# EAGLE design ControlBoard (EAGLE 8.2.2)
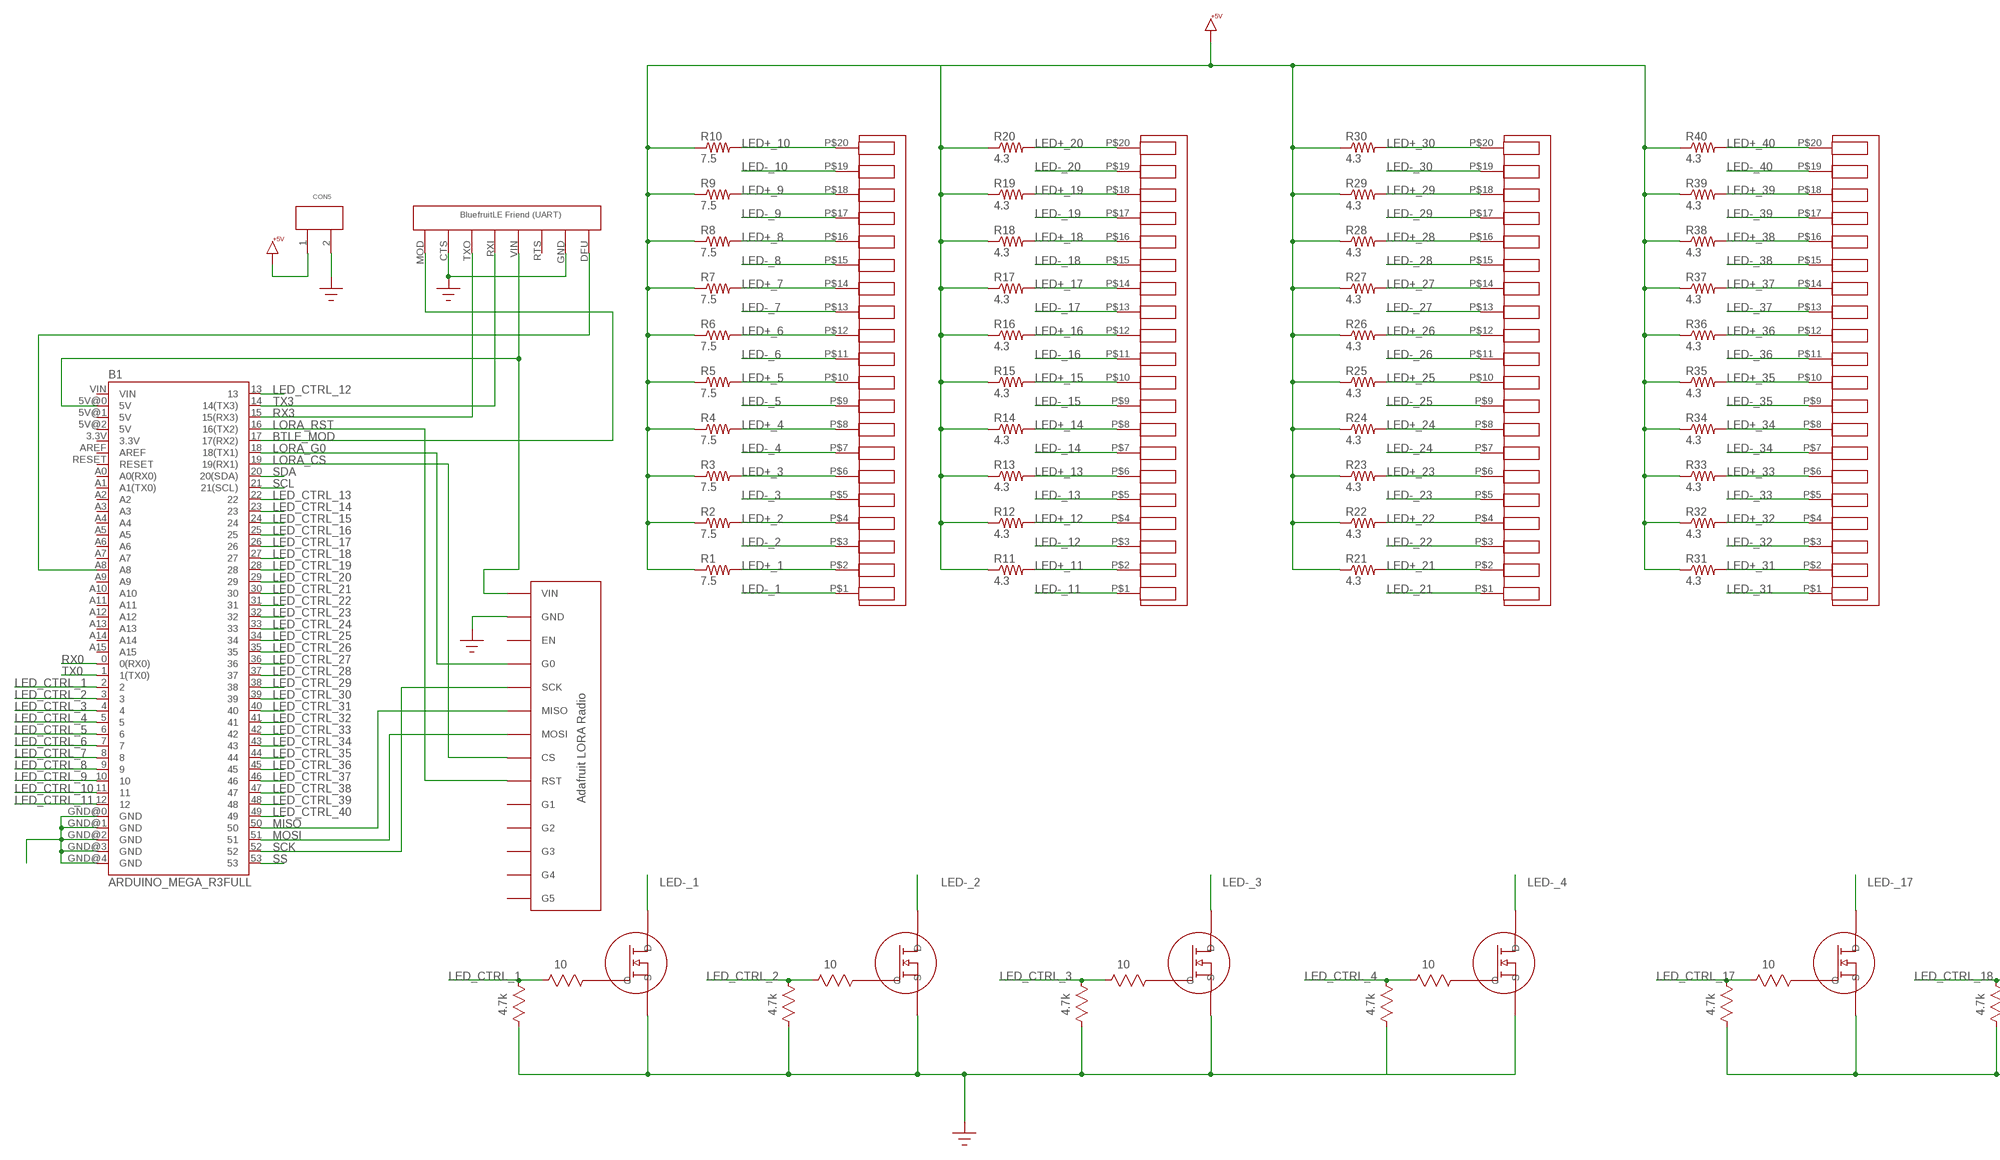
[diagram p0: schematic, sheet 1, part 1 of 3]
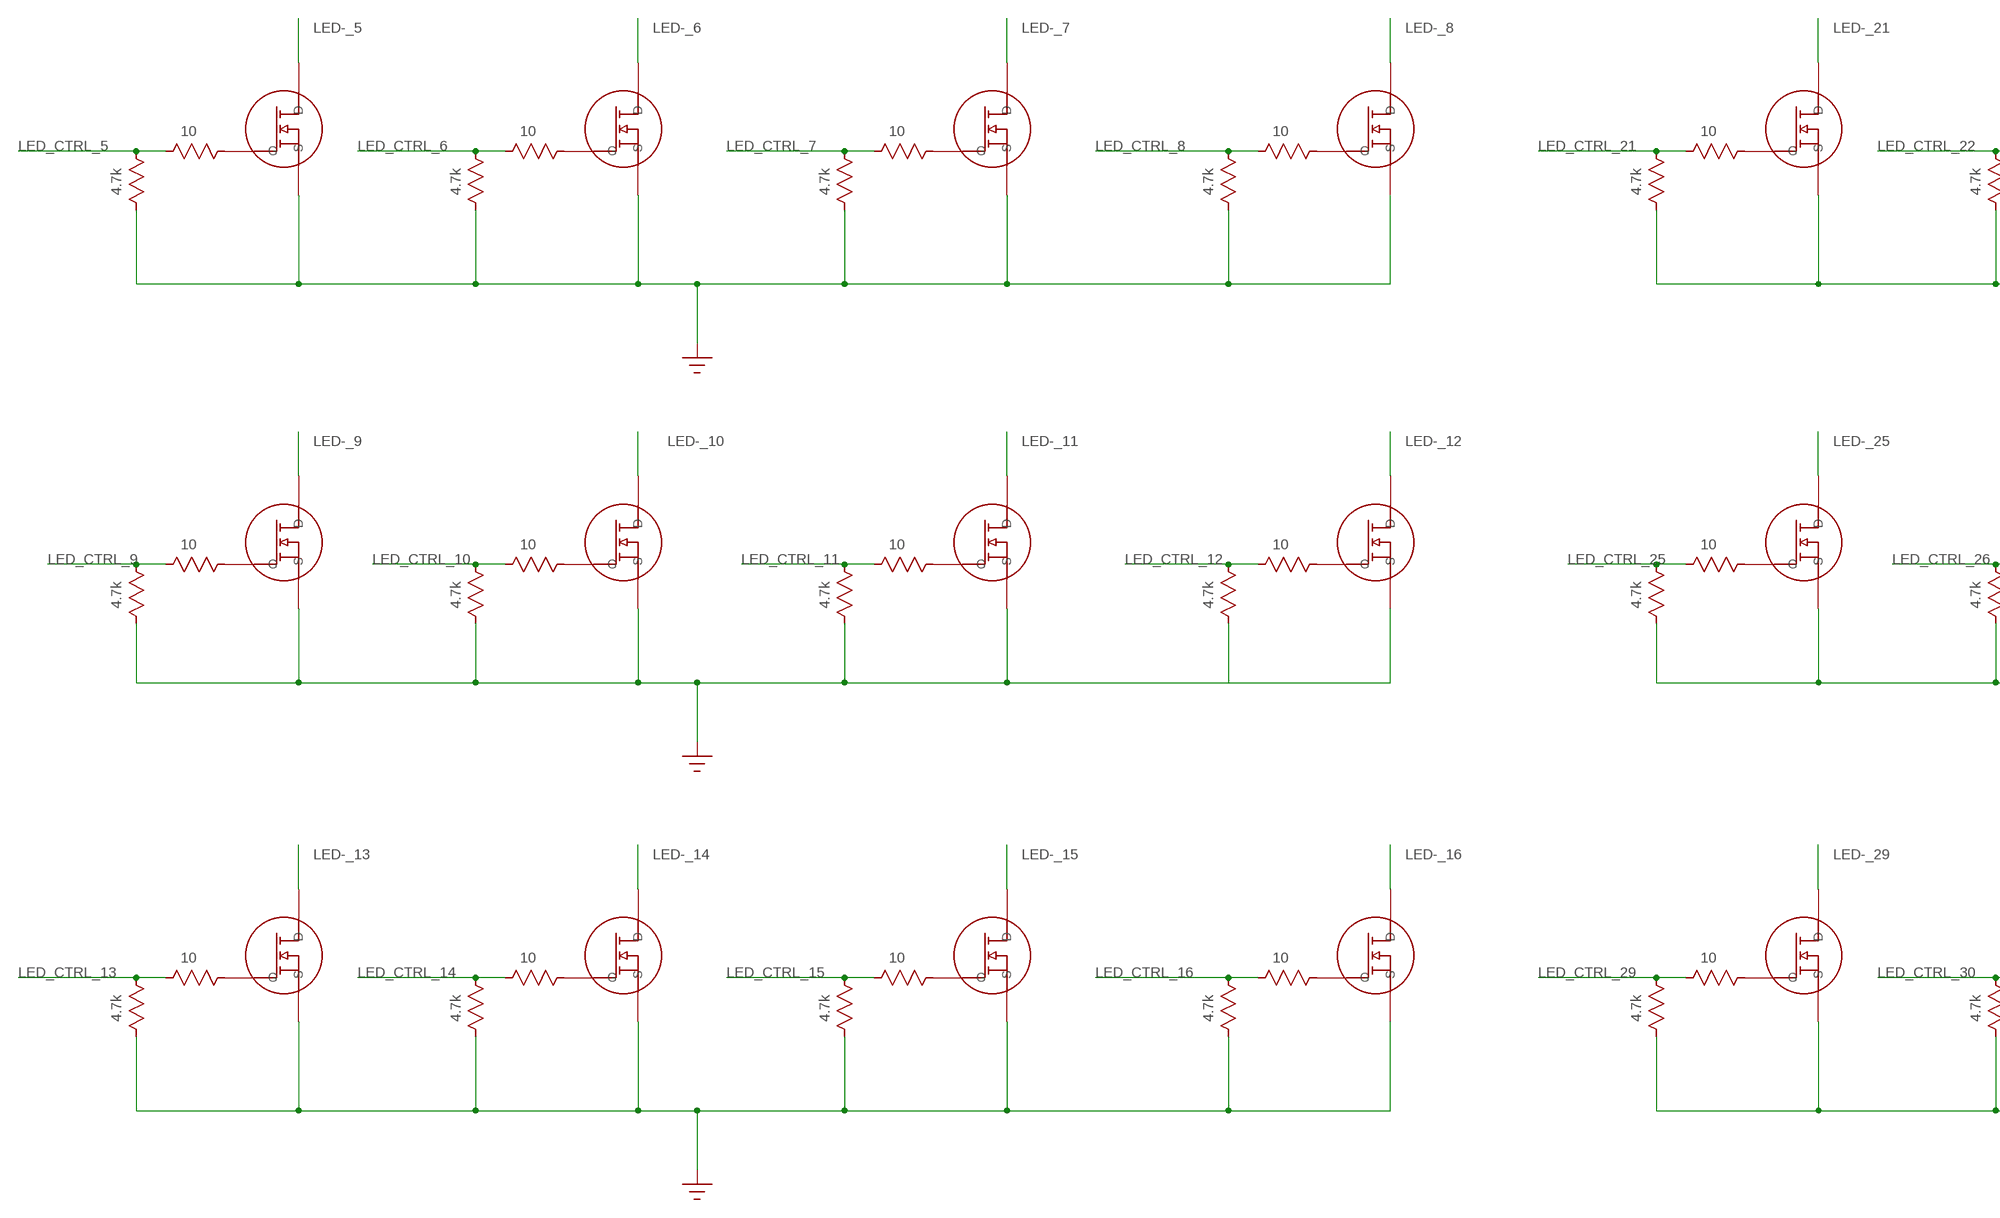
[diagram p1: schematic, sheet 1, part 2 of 3]
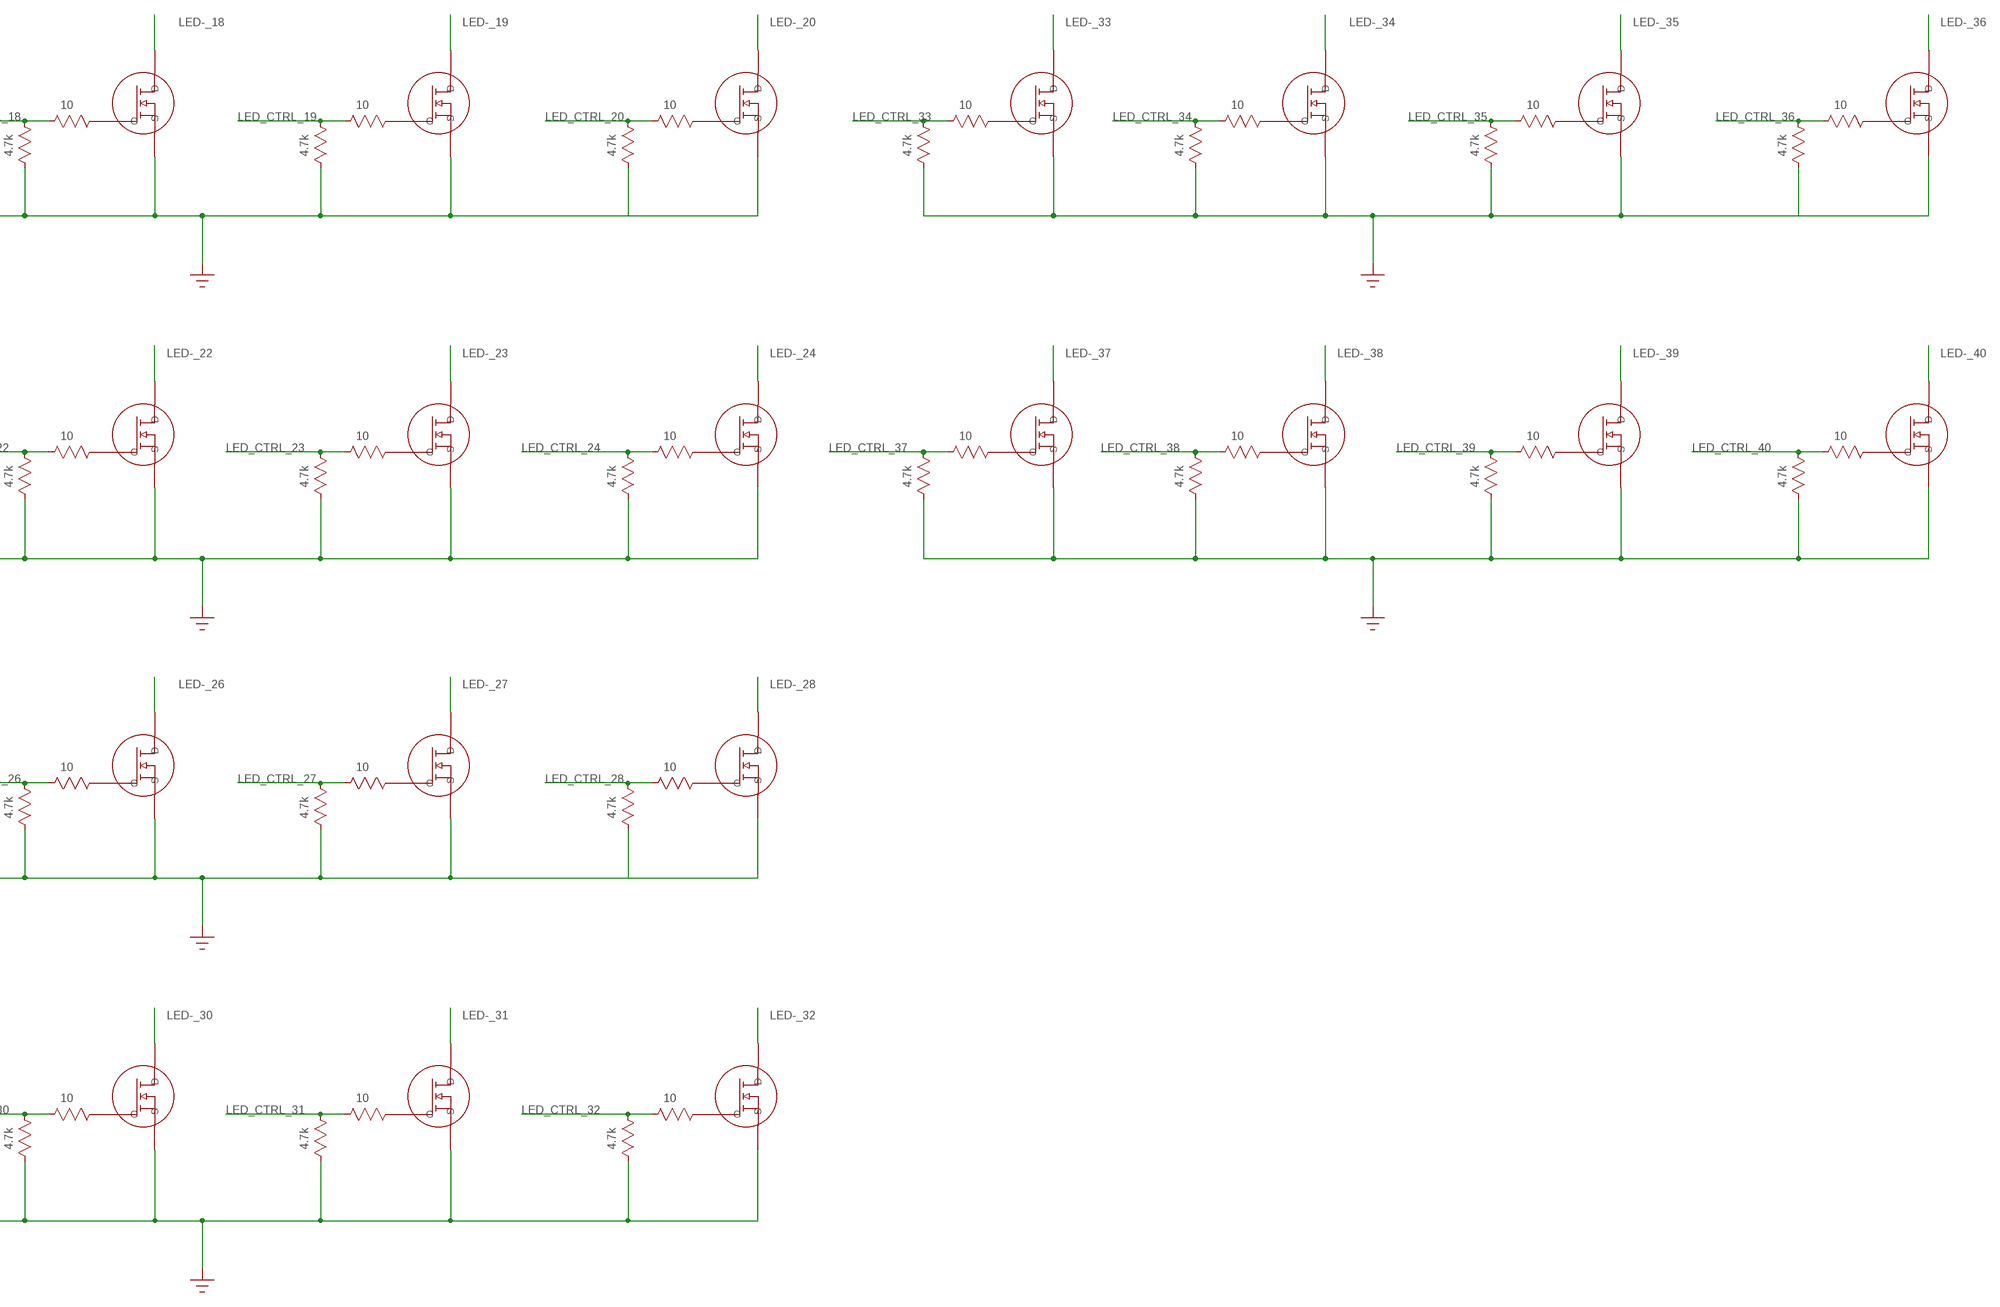
[diagram p2: schematic, sheet 1, part 3 of 3]

## Parts
B1  ARDUINO_MEGA_R3FULL  [ARDUINO_MEGA]
CON1  CONN_20  [SPRING_CAGE_X20_1990180]
CON2  CONN_20  [SPRING_CAGE_X20_1990180]
CON3  CONN_20  [SPRING_CAGE_X20_1990180]
CON4  CONN_20  [SPRING_CAGE_X20_1990180]
CON5  CONN_2  [TERMINAL_BLOCK-2X_1792229]
R1  7.5  RESISTORPTH-2W_RADIAL  [RADIAL-RES-2W]
R2  7.5  RESISTORPTH-2W_RADIAL  [RADIAL-RES-2W]
R3  7.5  RESISTORPTH-2W_RADIAL  [RADIAL-RES-2W]
R4  7.5  RESISTORPTH-2W_RADIAL  [RADIAL-RES-2W]
R5  7.5  RESISTORPTH-2W_RADIAL  [RADIAL-RES-2W]
R6  7.5  RESISTORPTH-2W_RADIAL  [RADIAL-RES-2W]
R7  7.5  RESISTORPTH-2W_RADIAL  [RADIAL-RES-2W]
R8  7.5  RESISTORPTH-2W_RADIAL  [RADIAL-RES-2W]
R9  7.5  RESISTORPTH-2W_RADIAL  [RADIAL-RES-2W]
R10  7.5  RESISTORPTH-2W_RADIAL  [RADIAL-RES-2W]
R11  4.3  RESISTORPTH-2W_RADIAL  [RADIAL-RES-2W]
R12  4.3  RESISTORPTH-2W_RADIAL  [RADIAL-RES-2W]
R13  4.3  RESISTORPTH-2W_RADIAL  [RADIAL-RES-2W]
R14  4.3  RESISTORPTH-2W_RADIAL  [RADIAL-RES-2W]
R15  4.3  RESISTORPTH-2W_RADIAL  [RADIAL-RES-2W]
R16  4.3  RESISTORPTH-2W_RADIAL  [RADIAL-RES-2W]
R17  4.3  RESISTORPTH-2W_RADIAL  [RADIAL-RES-2W]
R18  4.3  RESISTORPTH-2W_RADIAL  [RADIAL-RES-2W]
R19  4.3  RESISTORPTH-2W_RADIAL  [RADIAL-RES-2W]
R20  4.3  RESISTORPTH-2W_RADIAL  [RADIAL-RES-2W]
R21  4.3  RESISTORPTH-2W_RADIAL  [RADIAL-RES-2W]
R22  4.3  RESISTORPTH-2W_RADIAL  [RADIAL-RES-2W]
R23  4.3  RESISTORPTH-2W_RADIAL  [RADIAL-RES-2W]
R24  4.3  RESISTORPTH-2W_RADIAL  [RADIAL-RES-2W]
R25  4.3  RESISTORPTH-2W_RADIAL  [RADIAL-RES-2W]
R26  4.3  RESISTORPTH-2W_RADIAL  [RADIAL-RES-2W]
R27  4.3  RESISTORPTH-2W_RADIAL  [RADIAL-RES-2W]
R28  4.3  RESISTORPTH-2W_RADIAL  [RADIAL-RES-2W]
R29  4.3  RESISTORPTH-2W_RADIAL  [RADIAL-RES-2W]
R30  4.3  RESISTORPTH-2W_RADIAL  [RADIAL-RES-2W]
R31  4.3  RESISTORPTH-2W_RADIAL  [RADIAL-RES-2W]
R32  4.3  RESISTORPTH-2W_RADIAL  [RADIAL-RES-2W]
R33  4.3  RESISTORPTH-2W_RADIAL  [RADIAL-RES-2W]
R34  4.3  RESISTORPTH-2W_RADIAL  [RADIAL-RES-2W]
R35  4.3  RESISTORPTH-2W_RADIAL  [RADIAL-RES-2W]
R36  4.3  RESISTORPTH-2W_RADIAL  [RADIAL-RES-2W]
R37  4.3  RESISTORPTH-2W_RADIAL  [RADIAL-RES-2W]
R38  4.3  RESISTORPTH-2W_RADIAL  [RADIAL-RES-2W]
R39  4.3  RESISTORPTH-2W_RADIAL  [RADIAL-RES-2W]
R40  4.3  RESISTORPTH-2W_RADIAL  [RADIAL-RES-2W]
R41  4.7k  RESISTOR_X8  [1506_X8]
R42  4.7k  RESISTOR_X8  [1506_X8]
R43  4.7k  RESISTOR_X8  [1506_X8]
R44  4.7k  RESISTOR_X8  [1506_X8]
R45  4.7k  RESISTOR_X8  [1506_X8]
R46  10  RESISTOR_X8  [1506_X8]
R47  10  RESISTOR_X8  [1506_X8]
R48  10  RESISTOR_X8  [1506_X8]
R49  10  RESISTOR_X8  [1506_X8]
R50  10  RESISTOR_X8  [1506_X8]
U$1  MOSFET  [SOT-23/TO-236]
U$2  MOSFET  [SOT-23/TO-236]
U$3  MOSFET  [SOT-23/TO-236]
U$4  MOSFET  [SOT-23/TO-236]
U$5  MOSFET  [SOT-23/TO-236]
U$6  MOSFET  [SOT-23/TO-236]
U$7  MOSFET  [SOT-23/TO-236]
U$8  MOSFET  [SOT-23/TO-236]
U$9  MOSFET  [SOT-23/TO-236]
U$10  MOSFET  [SOT-23/TO-236]
U$15  MOSFET  [SOT-23/TO-236]
U$16  MOSFET  [SOT-23/TO-236]
U$17  MOSFET  [SOT-23/TO-236]
U$18  MOSFET  [SOT-23/TO-236]
U$19  MOSFET  [SOT-23/TO-236]
U$20  MOSFET  [SOT-23/TO-236]
U$21  MOSFET  [SOT-23/TO-236]
U$22  MOSFET  [SOT-23/TO-236]
U$27  MOSFET  [SOT-23/TO-236]
U$28  MOSFET  [SOT-23/TO-236]
U$29  MOSFET  [SOT-23/TO-236]
U$30  MOSFET  [SOT-23/TO-236]
U$31  MOSFET  [SOT-23/TO-236]
U$32  MOSFET  [SOT-23/TO-236]
U$37  MOSFET  [SOT-23/TO-236]
U$38  MOSFET  [SOT-23/TO-236]
U$39  MOSFET  [SOT-23/TO-236]
U$40  MOSFET  [SOT-23/TO-236]
U$41  MOSFET  [SOT-23/TO-236]
U$42  MOSFET  [SOT-23/TO-236]
U$43  MOSFET  [SOT-23/TO-236]
U$44  MOSFET  [SOT-23/TO-236]
U$49  MOSFET  [SOT-23/TO-236]
U$50  MOSFET  [SOT-23/TO-236]
U$51  MOSFET  [SOT-23/TO-236]
U$52  MOSFET  [SOT-23/TO-236]
U$53  MOSFET  [SOT-23/TO-236]
U$54  MOSFET  [SOT-23/TO-236]
U$55  MOSFET  [SOT-23/TO-236]
U$56  MOSFET  [SOT-23/TO-236]
U$62  BLUEFRUIT_LE_FRIEND_UART  [BLUEFRUIT_LE_FRIEND_UART]
U$64  ADAFRUIT_LORA_RADIO  [ADAFRUIT_LORA_RADIO]

## Nets
+5V [LED_PWR]: CON5.1 R1.P$1 R2.P$1 R3.P$1 R4.P$1 R5.P$1 R6.P$1 R7.P$1 R8.P$1 R9.P$1 R10.P$1 R11.P$1 R12.P$1 R13.P$1 R14.P$1 R15.P$1 R16.P$1 R17.P$1 R18.P$1 R19.P$1 R20.P$1 R21.P$1 R22.P$1 R23.P$1 R24.P$1 R25.P$1 R26.P$1 R27.P$1 R28.P$1 R29.P$1 R30.P$1 R31.P$1 R32.P$1 R33.P$1 R34.P$1 R35.P$1 R36.P$1 R37.P$1 R38.P$1 R39.P$1 R40.P$1
BTLE_DFU: B1.A8 U$62.DFU
BTLE_MOD: B1.17(17(RX2)) U$62.MOD
GND: B1.GND@0(GND) B1.GND@1(GND) B1.GND@2(GND) B1.GND@3(GND) B1.GND@4(GND) CON5.2 R41.P$1 R41.P$2 R41.P$3 R41.P$4 R41.P$5 R41.P$6 R41.P$7 R41.P$8 R42.P$1 R42.P$2 R42.P$3 R42.P$4 R42.P$5 R42.P$6 R42.P$7 R42.P$8 R43.P$1 R43.P$2 R43.P$3 R43.P$4 R43.P$5 R43.P$6 R43.P$7 R43.P$8 R44.P$1 R44.P$2 R44.P$3 R44.P$4 R44.P$5 R44.P$6 R44.P$7 R44.P$8 R45.P$1 R45.P$2 R45.P$3 R45.P$4 R45.P$5 R45.P$6 R45.P$7 R45.P$8 U$1.P$2(S) U$2.P$2(S) U$3.P$2(S) U$4.P$2(S) U$5.P$2(S) U$6.P$2(S) U$7.P$2(S) U$8.P$2(S) U$9.P$2(S) U$10.P$2(S) U$15.P$2(S) U$16.P$2(S) U$17.P$2(S) U$18.P$2(S) U$19.P$2(S) U$20.P$2(S) U$21.P$2(S) U$22.P$2(S) U$27.P$2(S) U$28.P$2(S) U$29.P$2(S) U$30.P$2(S) U$31.P$2(S) U$32.P$2(S) U$37.P$2(S) U$38.P$2(S) U$39.P$2(S) U$40.P$2(S) U$41.P$2(S) U$42.P$2(S) U$43.P$2(S) U$44.P$2(S) U$49.P$2(S) U$50.P$2(S) U$51.P$2(S) U$52.P$2(S) U$53.P$2(S) U$54.P$2(S) U$55.P$2(S) U$56.P$2(S) U$62.CTS U$62.GND U$64.P$2(GND)
LED+_1: CON1.P$2 R1.P$2
LED+_2: CON1.P$4 R2.P$2
LED+_3: CON1.P$6 R3.P$2
LED+_4: CON1.P$8 R4.P$2
LED+_5: CON1.P$10 R5.P$2
LED+_6: CON1.P$12 R6.P$2
LED+_7: CON1.P$14 R7.P$2
LED+_8: CON1.P$16 R8.P$2
LED+_9: CON1.P$18 R9.P$2
LED+_10: CON1.P$20 R10.P$2
LED+_11: CON2.P$2 R11.P$2
LED+_12: CON2.P$4 R12.P$2
LED+_13: CON2.P$6 R13.P$2
LED+_14: CON2.P$8 R14.P$2
LED+_15: CON2.P$10 R15.P$2
LED+_16: CON2.P$12 R16.P$2
LED+_17: CON2.P$14 R17.P$2
LED+_18: CON2.P$16 R18.P$2
LED+_19: CON2.P$18 R19.P$2
LED+_20: CON2.P$20 R20.P$2
LED+_21: CON3.P$2 R21.P$2
LED+_22: CON3.P$4 R22.P$2
LED+_23: CON3.P$6 R23.P$2
LED+_24: CON3.P$8 R24.P$2
LED+_25: CON3.P$10 R25.P$2
LED+_26: CON3.P$12 R26.P$2
LED+_27: CON3.P$14 R27.P$2
LED+_28: CON3.P$16 R28.P$2
LED+_29: CON3.P$18 R29.P$2
LED+_30: CON3.P$20 R30.P$2
LED+_31: CON4.P$2 R31.P$2
LED+_32: CON4.P$4 R32.P$2
LED+_33: CON4.P$6 R33.P$2
LED+_34: CON4.P$8 R34.P$2
LED+_35: CON4.P$10 R35.P$2
LED+_36: CON4.P$12 R36.P$2
LED+_37: CON4.P$14 R37.P$2
LED+_38: CON4.P$16 R38.P$2
LED+_39: CON4.P$18 R39.P$2
LED+_40: CON4.P$20 R40.P$2
LED-_1 [LED_PWR]: CON1.P$1 U$3.P$3(D)
LED-_2 [LED_PWR]: CON1.P$3 U$4.P$3(D)
LED-_3 [LED_PWR]: CON1.P$5 U$5.P$3(D)
LED-_4 [LED_PWR]: CON1.P$7 U$6.P$3(D)
LED-_5 [LED_PWR]: CON1.P$9 U$7.P$3(D)
LED-_6 [LED_PWR]: CON1.P$11 U$8.P$3(D)
LED-_7 [LED_PWR]: CON1.P$13 U$9.P$3(D)
LED-_8 [LED_PWR]: CON1.P$15 U$10.P$3(D)
LED-_9 [LED_PWR]: CON1.P$17 U$15.P$3(D)
LED-_10 [LED_PWR]: CON1.P$19 U$16.P$3(D)
LED-_11 [LED_PWR]: CON2.P$1 U$17.P$3(D)
LED-_12 [LED_PWR]: CON2.P$3 U$18.P$3(D)
LED-_13 [LED_PWR]: CON2.P$5 U$19.P$3(D)
LED-_14 [LED_PWR]: CON2.P$7 U$20.P$3(D)
LED-_15 [LED_PWR]: CON2.P$9 U$21.P$3(D)
LED-_16 [LED_PWR]: CON2.P$11 U$22.P$3(D)
LED-_17 [LED_PWR]: CON2.P$13 U$1.P$3(D)
LED-_18 [LED_PWR]: CON2.P$15 U$2.P$3(D)
LED-_19 [LED_PWR]: CON2.P$17 U$27.P$3(D)
LED-_20 [LED_PWR]: CON2.P$19 U$28.P$3(D)
LED-_21 [LED_PWR]: CON3.P$1 U$29.P$3(D)
LED-_22 [LED_PWR]: CON3.P$3 U$30.P$3(D)
LED-_23 [LED_PWR]: CON3.P$5 U$31.P$3(D)
LED-_24 [LED_PWR]: CON3.P$7 U$32.P$3(D)
LED-_25 [LED_PWR]: CON3.P$9 U$37.P$3(D)
LED-_26 [LED_PWR]: CON3.P$11 U$38.P$3(D)
LED-_27 [LED_PWR]: CON3.P$13 U$39.P$3(D)
LED-_28 [LED_PWR]: CON3.P$15 U$40.P$3(D)
LED-_29 [LED_PWR]: CON3.P$17 U$41.P$3(D)
LED-_30 [LED_PWR]: CON3.P$19 U$42.P$3(D)
LED-_31 [LED_PWR]: CON4.P$1 U$43.P$3(D)
LED-_32 [LED_PWR]: CON4.P$3 U$44.P$3(D)
LED-_33 [LED_PWR]: CON4.P$5 U$49.P$3(D)
LED-_34 [LED_PWR]: CON4.P$7 U$50.P$3(D)
LED-_35 [LED_PWR]: CON4.P$9 U$51.P$3(D)
LED-_36 [LED_PWR]: CON4.P$11 U$52.P$3(D)
LED-_37 [LED_PWR]: CON4.P$13 U$53.P$3(D)
LED-_38 [LED_PWR]: CON4.P$15 U$54.P$3(D)
LED-_39 [LED_PWR]: CON4.P$17 U$55.P$3(D)
LED-_40 [LED_PWR]: CON4.P$19 U$56.P$3(D)
LED_CTRL_1: B1.2 R41.P$16 R46.P$1
LED_CTRL_2: B1.3 R41.P$15 R46.P$2
LED_CTRL_3: B1.4 R41.P$14 R46.P$3
LED_CTRL_4: B1.5 R41.P$13 R46.P$4
LED_CTRL_5: B1.6 R41.P$12 R46.P$5
LED_CTRL_6: B1.7 R41.P$11 R46.P$6
LED_CTRL_7: B1.8 R41.P$10 R46.P$7
LED_CTRL_8: B1.9 R41.P$9 R46.P$8
LED_CTRL_9: B1.10 R42.P$16 R47.P$1
LED_CTRL_10: B1.11 R42.P$15 R47.P$2
LED_CTRL_11: B1.12 R42.P$14 R47.P$3
LED_CTRL_12: B1.13 R42.P$13 R47.P$4
LED_CTRL_13: B1.22 R42.P$12 R47.P$5
LED_CTRL_14: B1.23 R42.P$11 R47.P$6
LED_CTRL_15: B1.24 R42.P$10 R47.P$7
LED_CTRL_16: B1.25 R42.P$9 R47.P$8
LED_CTRL_17: B1.26 R43.P$16 R48.P$1
LED_CTRL_18: B1.27 R43.P$15 R48.P$2
LED_CTRL_19: B1.28 R43.P$14 R48.P$3
LED_CTRL_20: B1.29 R43.P$13 R48.P$4
LED_CTRL_21: B1.30 R43.P$12 R48.P$5
LED_CTRL_22: B1.31 R43.P$11 R48.P$6
LED_CTRL_23: B1.32 R43.P$10 R48.P$7
LED_CTRL_24: B1.33 R43.P$9 R48.P$8
LED_CTRL_25: B1.34 R44.P$16 R49.P$1
LED_CTRL_26: B1.35 R44.P$15 R49.P$2
LED_CTRL_27: B1.36 R44.P$14 R49.P$3
LED_CTRL_28: B1.37 R44.P$13 R49.P$4
LED_CTRL_29: B1.38 R44.P$12 R49.P$5
LED_CTRL_30: B1.39 R44.P$11 R49.P$6
LED_CTRL_31: B1.40 R44.P$10 R49.P$7
LED_CTRL_32: B1.41 R44.P$9 R49.P$8
LED_CTRL_33: B1.42 R45.P$16 R50.P$1
LED_CTRL_34: B1.43 R45.P$15 R50.P$2
LED_CTRL_35: B1.44 R45.P$14 R50.P$3
LED_CTRL_36: B1.45 R45.P$13 R50.P$4
LED_CTRL_37: B1.46 R45.P$12 R50.P$5
LED_CTRL_38: B1.47 R45.P$11 R50.P$6
LED_CTRL_39: B1.48 R45.P$10 R50.P$7
LED_CTRL_40: B1.49 R45.P$9 R50.P$8
LORA_CS: B1.19(19(RX1)) U$64.P$8(CS)
LORA_G0: B1.18(18(TX1)) U$64.P$4(G0)
LORA_RST: B1.16(16(TX2)) U$64.P$9(RST)
MCU_5V: B1.5V@0(5V) U$62.VIN U$64.P$1(VIN)
MISO: B1.50 U$64.P$6(MISO)
MOSI: B1.51 U$64.P$7(MOSI)
N$1: R46.P$16 U$3.P$1(G)
N$2: R46.P$15 U$4.P$1(G)
N$3: R46.P$14 U$5.P$1(G)
N$4: R46.P$13 U$6.P$1(G)
N$5: R46.P$12 U$7.P$1(G)
N$6: R46.P$11 U$8.P$1(G)
N$7: R46.P$10 U$9.P$1(G)
N$8: R46.P$9 U$10.P$1(G)
N$9: R47.P$16 U$15.P$1(G)
N$10: R47.P$15 U$16.P$1(G)
N$11: R47.P$14 U$17.P$1(G)
N$12: R47.P$13 U$18.P$1(G)
N$13: R47.P$12 U$19.P$1(G)
N$14: R47.P$11 U$20.P$1(G)
N$15: R47.P$10 U$21.P$1(G)
N$16: R47.P$9 U$22.P$1(G)
N$17: R48.P$16 U$1.P$1(G)
N$18: R48.P$15 U$2.P$1(G)
N$19: R48.P$14 U$27.P$1(G)
N$20: R48.P$13 U$28.P$1(G)
N$21: R48.P$12 U$29.P$1(G)
N$22: R48.P$11 U$30.P$1(G)
N$23: R48.P$10 U$31.P$1(G)
N$24: R48.P$9 U$32.P$1(G)
N$25: R49.P$16 U$37.P$1(G)
N$26: R49.P$15 U$38.P$1(G)
N$27: R49.P$14 U$39.P$1(G)
N$28: R49.P$13 U$40.P$1(G)
N$29: R49.P$12 U$41.P$1(G)
N$30: R49.P$11 U$42.P$1(G)
N$31: R49.P$10 U$43.P$1(G)
N$32: R49.P$9 U$44.P$1(G)
N$33: R50.P$16 U$49.P$1(G)
N$34: R50.P$15 U$50.P$1(G)
N$35: R50.P$14 U$51.P$1(G)
N$36: R50.P$13 U$52.P$1(G)
N$37: R50.P$12 U$53.P$1(G)
N$38: R50.P$11 U$54.P$1(G)
N$39: R50.P$10 U$55.P$1(G)
N$40: R50.P$9 U$56.P$1(G)
RX0: B1.0(0(RX0))
RX3: B1.15(15(RX3)) U$62.TXO
SCK: B1.52 U$64.P$5(SCK)
SCL: B1.21(21(SCL))
SDA: B1.20(20(SDA))
SS: B1.53
TX0: B1.1(1(TX0))
TX3: B1.14(14(TX3)) U$62.RXI
Unconnected: B1.3.3V B1.5V@1(5V) B1.5V@2(5V) B1.A0(A0(RX0)) B1.A1(A1(TX0)) B1.A2 B1.A3 B1.A4 B1.A5 B1.A6 B1.A7 B1.A9 B1.A10 B1.A11 B1.A12 B1.A13 B1.A14 B1.A15 B1.AREF B1.RESET B1.VIN U$62.RTS U$64.P$3(EN) U$64.P$10(G1) U$64.P$11(G2) U$64.P$12(G3) U$64.P$13(G4) U$64.P$14(G5)

## Library data of the parts
B1 = SparkFun-Boards:ARDUINO_MEGA_R3: Arduino Mega R3 ATmega2560 R3 compatible footprint. SparkFun Products: Arduino Mega 2560 R3 <https://www.sparkfun.com/products/11061>
CON1-CON4 = TinkerTech:CONN_20
CON5 = TinkerTech:CONN_2
R1-R40 = TinkerTech:RESISTOR: Resistor Basic schematic elements and footprints for 0603, 1206, and PTH resistors.
R41-R50 = TinkerTech:RESISTOR_X8
U$1-U$10 U$15-U$22 U$27-U$32 U$37-U$44 U$49-U$56 = TinkerTech:MOSFET
U$62 = TinkerTech:BLUEFRUIT_LE_FRIEND_UART
U$64 = TinkerTech:ADAFRUIT_LORA_RADIO

## Net classes
1 LED_PWR: width 0.254 mm

## Board
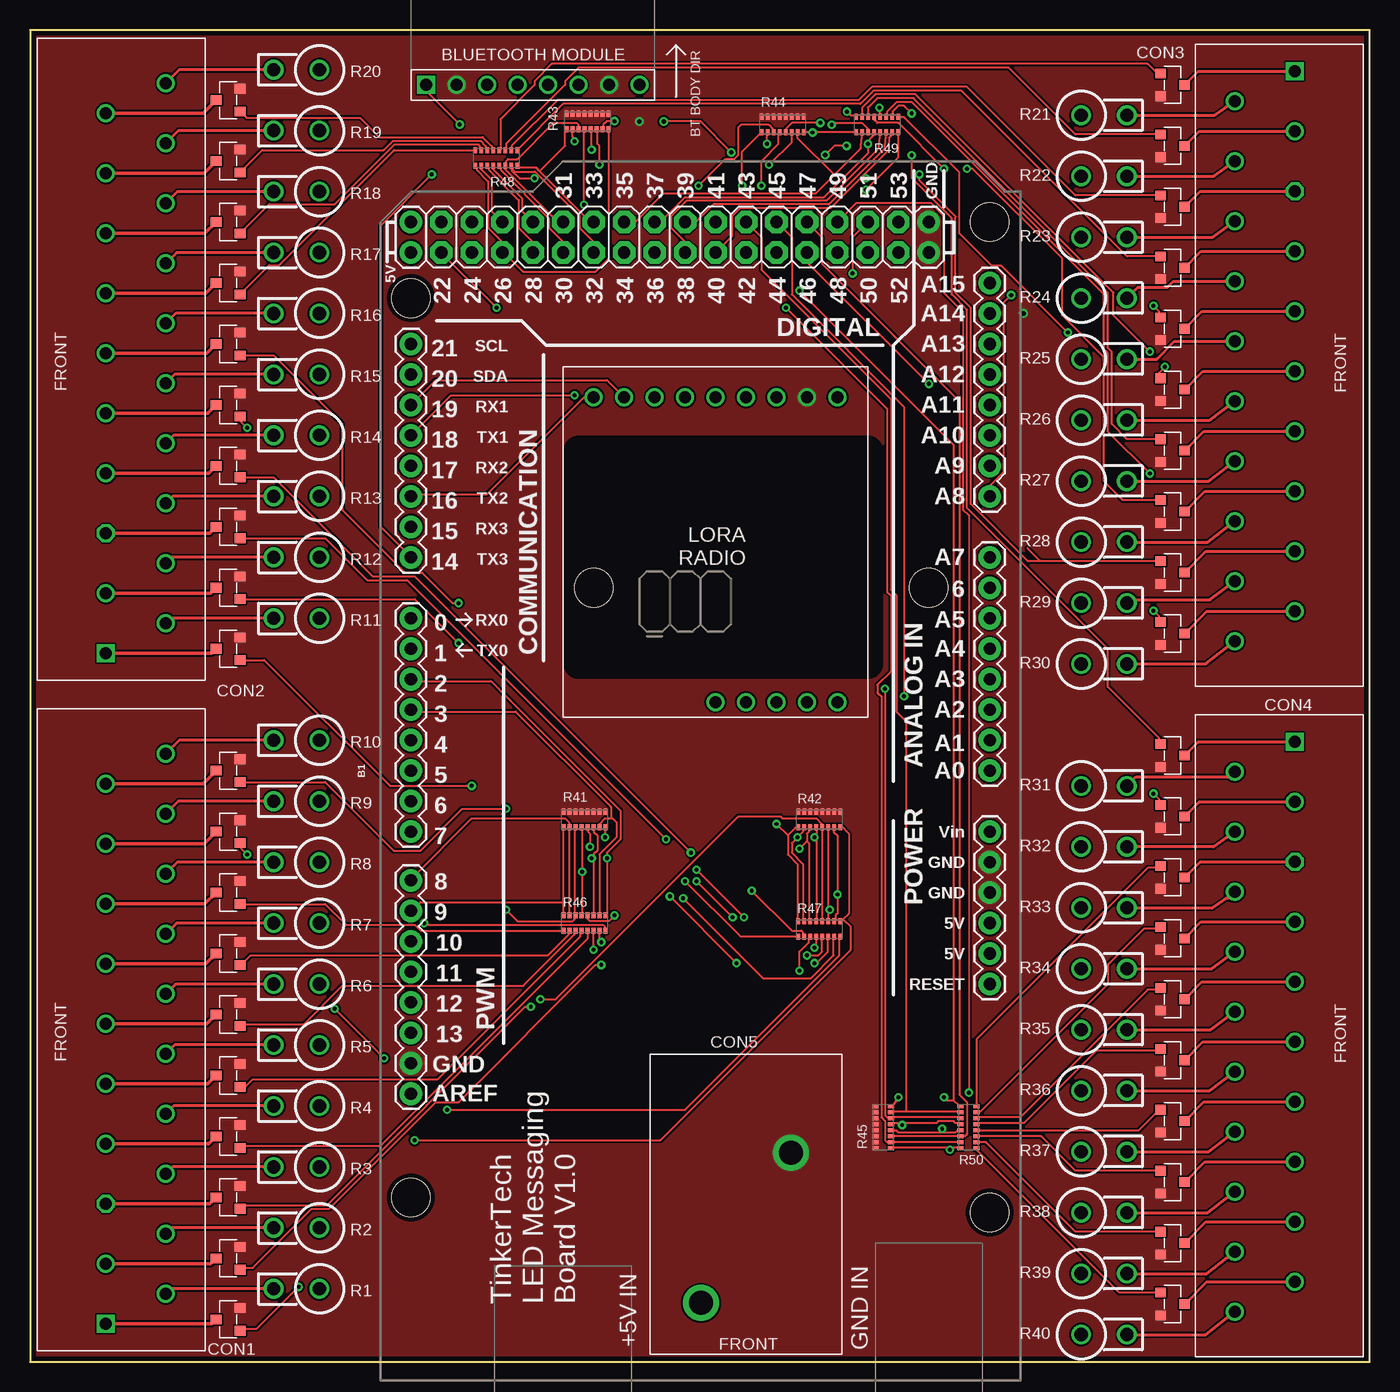
[diagram p3: board, top side]
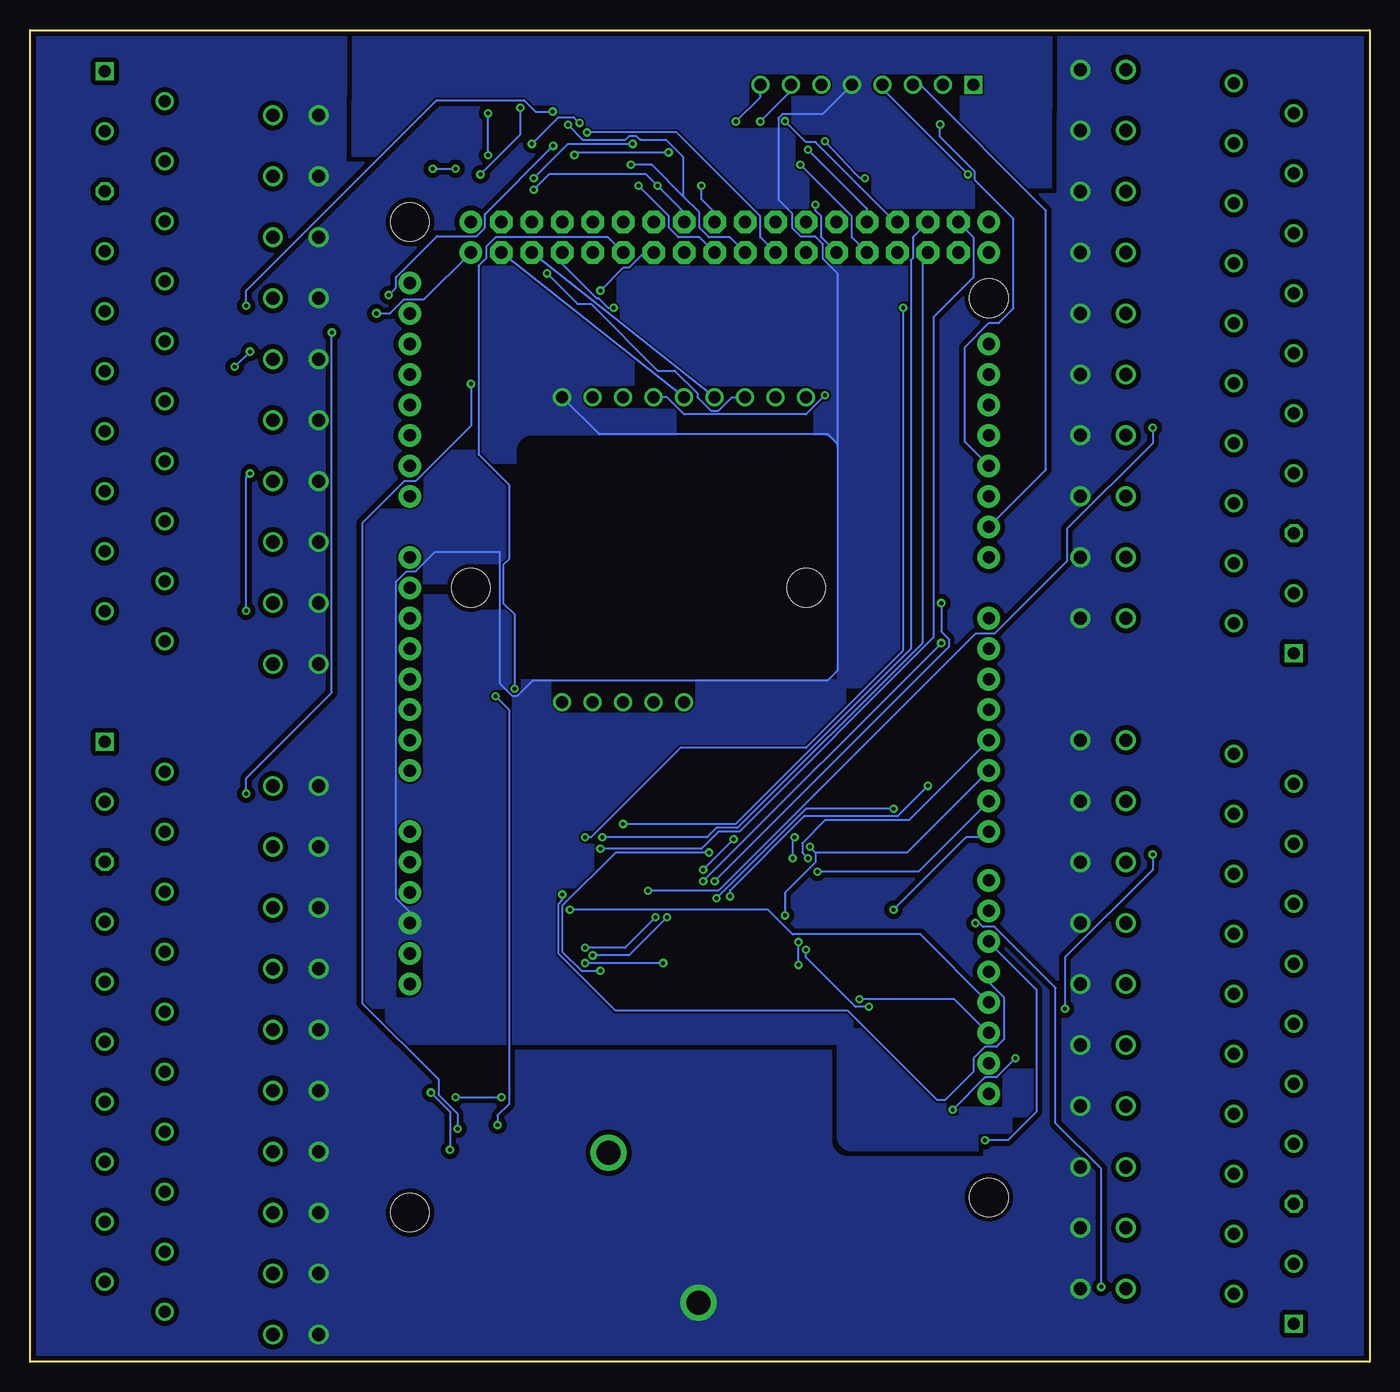
[diagram p4: board, bottom side, seen from below]

Size 111.68 x 111 mm. Coordinates in mm from the lower left corner, seen from the top.
Outline: 0,0 111.68,0 111.68,111 0,111 0,0
Copper layers (1*16): Top 0.0356mm / dielectric 1.5011mm / Bottom 0.0356mm
Design rules "oshpark-2layer *": minimum track width 6mil, minimum drill 13mil, track to track 6mil, track to pad 6mil, pad to pad 6mil, via to via 6mil, smd to smd 6mil, copper to edge 15mil, drill to drill 6mil, minimum pad ring 7mil, minimum via ring 7mil, stop-mask expansion 2.5mil, vias tented up to drill 15mil, thermal gap 10mil
tRestrict: area 45.7,58.2 to 69.8,75.9
bRestrict: area 45.7,58.2 to 69.8,75.9

### Footprints (pad centres in the part's own frame; a part is rotated, then mirrored left to right if it is on the bottom)
ARDUINO_MEGA = drill 1.016 pad 1.88: 0 13.97,24.13; 1 11.43,24.13; 2 8.89,24.13; 3 6.35,24.13; 3.3V -13.97,-24.13; 4 3.81,24.13; 5 1.27,24.13; 5V@0 -11.43,-24.13; 5V@1 44.45,24.13; 5V@2 46.99,24.13; 6 -1.27,24.13; 7 -3.81,24.13; 8 -7.874,24.13; 9 -10.414,24.13; 10 -12.954,24.13; 11 -15.494,24.13; 12 -18.034,24.13; 13 -20.574,24.13; 14 19.05,24.13; 15 21.59,24.13; 16 24.13,24.13; 17 26.67,24.13; 18 29.21,24.13; 19 31.75,24.13; 20 34.29,24.13; 21 36.83,24.13; A0 1.27,-24.13; A1 3.81,-24.13; A2 6.35,-24.13; A3 8.89,-24.13; A4 11.43,-24.13; A5 13.97,-24.13; A6 16.51,-24.13; A7 19.05,-24.13; A8 24.13,-24.13; A9 26.67,-24.13; A10 29.21,-24.13; A11 31.75,-24.13; A12 34.29,-24.13; A13 36.83,-24.13; A14 39.37,-24.13; A15 41.91,-24.13; AREF -25.654,24.13; GND@0 -8.89,-24.13; GND@1 -6.35,-24.13; GND@2 44.45,-19.05; GND@3 46.99,-19.05; GND@4 -23.114,24.13; RESET -16.51,-24.13; VIN -3.81,-24.13 | drill 1.016 pad 1.88 octagon: 22 44.45,21.59; 23 46.99,21.59; 24 44.45,19.05; 25 46.99,19.05; 26 44.45,16.51; 27 46.99,16.51; 28 44.45,13.97; 29 46.99,13.97; 30 44.45,11.43; 31 46.99,11.43; 32 44.45,8.89; 33 46.99,8.89; 34 44.45,6.35; 35 46.99,6.35; 36 44.45,3.81; 37 46.99,3.81; 38 44.45,1.27; 39 46.99,1.27; 40 44.45,-1.27; 41 46.99,-1.27; 42 44.45,-3.81; 43 46.99,-3.81; 44 44.45,-6.35; 45 46.99,-6.35; 46 44.45,-8.89; 47 46.99,-8.89; 48 44.45,-11.43; 49 46.99,-11.43; 50 44.45,-13.97; 51 46.99,-13.97; 52 44.45,-16.51; 53 46.99,-16.51 | hole 3.2: -34.29,24.13; -35.56,-24.13; 16.51,8.89; 16.51,-19.05; 40.64,24.13; 46.99,-24.13
SPRING_CAGE_X20_1990180 = drill 1 square: P$1 24.5,-1.3 | drill 1: P$2 22,3.7; P$3 19.5,-1.3; P$4 17,3.7; P$6 12,3.7; P$7 9.5,-1.3; P$8 7,3.7; P$9 4.5,-1.3; P$10 2,3.7; P$11 -0.5,-1.3; P$12 -3,3.7; P$13 -5.5,-1.3; P$14 -8,3.7; P$15 -10.5,-1.3; P$16 -13,3.7; P$17 -15.5,-1.3; P$18 -18,3.7; P$19 -20.5,-1.3; P$20 -23,3.7 | drill 1 octagon: P$5 14.5,-1.3
TERMINAL_BLOCK-2X_1792229 = drill 2: 1 -3.75,-6.25; 2 3.75,6.25
RADIAL-RES-2W = drill 1.1: P$1 -1.27,0; P$2 2.54,0
1506_X8 = smd 0.3 x 0.5: P$1 -1.75,-0.65; P$2 -1.25,-0.65; P$3 -0.75,-0.65; P$4 -0.25,-0.65; P$5 0.25,-0.65; P$6 0.75,-0.65; P$7 1.25,-0.65; P$8 1.75,-0.65; P$9 1.75,0.65; P$10 1.25,0.65; P$11 0.75,0.65; P$12 0.25,0.65; P$13 -0.25,0.65; P$14 -0.75,0.65; P$15 -1.25,0.65; P$16 -1.75,0.65
SOT-23/TO-236 = smd 0.8 x 0.9: P$1 -0.95,-1; P$2 0.95,-1; P$3 0,1
BLUEFRUIT_LE_FRIEND_UART = drill 1: CTS -6.35,0; DFU 8.89,0; GND 6.35,0; RTS 3.81,0; RXI -1.27,0; TXO -3.81,0; VIN 1.27,0 | drill 1 square: MOD -8.89,0
ADAFRUIT_LORA_RADIO = drill 1: P$1 -10.16,-12.065; P$2 -7.62,-12.065; P$3 -5.08,-12.065; P$4 -2.54,-12.065; P$5 0,-12.065; P$6 2.54,-12.065; P$7 5.08,-12.065; P$8 7.62,-12.065; P$9 10.16,-12.065; P$10 -10.16,13.335; P$11 -7.62,13.335; P$12 -5.08,13.335; P$13 -2.54,13.335; P$14 0,13.335

### Placement (x,y rotation side)
B1  55.88,48.01 90 top
CON1  7.62,27.69 270 top
CON2  7.62,83.57 270 top
CON3  104.14,83.06 90 top
CON4  104.14,27.18 90 top
CON5  59.69,11.18 0 top
R1  22.86,6.1 180 top
R2  22.86,11.18 180 top
R3  22.86,16.26 180 top
R4  22.86,21.34 180 top
R5  22.86,26.42 180 top
R6  22.86,31.5 180 top
R7  22.86,36.58 180 top
R8  22.86,41.66 180 top
R9  22.86,46.74 180 top
R10  22.86,51.82 180 top
R11  22.86,61.98 180 top
R12  22.86,67.06 180 top
R13  22.86,72.14 180 top
R14  22.86,77.22 180 top
R15  22.86,82.3 180 top
R16  22.86,87.38 180 top
R17  22.86,92.46 180 top
R18  22.86,97.54 180 top
R19  22.86,102.62 180 top
R20  22.86,107.7 180 top
R21  88.9,103.89 0 top
R22  88.9,98.81 0 top
R23  88.9,93.73 0 top
R24  88.9,88.65 0 top
R25  88.9,83.57 0 top
R26  88.9,78.49 0 top
R27  88.9,73.41 0 top
R28  88.9,68.33 0 top
R29  88.9,63.25 0 top
R30  88.9,58.17 0 top
R31  88.9,48.01 0 top
R32  88.9,42.93 0 top
R33  88.9,37.85 0 top
R34  88.9,32.77 0 top
R35  88.9,27.69 0 top
R36  88.9,22.61 0 top
R37  88.9,17.53 0 top
R38  88.9,12.45 0 top
R39  88.9,7.37 0 top
R40  88.9,2.29 0 top
R41  46.23,45.21 180 top
R42  65.79,45.21 180 top
R43  46.48,103.38 180 top
R44  62.74,103.12 180 top
R45  71.12,19.56 270 top
R46  46.23,36.58 180 top
R47  65.79,36.07 180 top
R48  38.86,100.33 0 top
R49  70.61,103.12 0 top
R50  78.23,19.56 270 top
U$1  16.51,89.92 90 top
U$2  16.51,95 90 top
U$3  16.51,3.56 90 top
U$4  16.51,8.64 90 top
U$5  16.51,13.72 90 top
U$6  16.51,18.8 90 top
U$7  16.51,23.88 90 top
U$8  16.51,28.96 90 top
U$9  16.51,34.04 90 top
U$10  16.51,39.12 90 top
U$15  16.51,44.2 90 top
U$16  16.51,49.28 90 top
U$17  16.51,59.44 90 top
U$18  16.51,64.52 90 top
U$19  16.51,69.6 90 top
U$20  16.51,74.68 90 top
U$21  16.51,79.76 90 top
U$22  16.51,84.84 90 top
U$27  16.51,100.08 90 top
U$28  16.51,105.16 90 top
U$29  95.25,106.43 270 top
U$30  95.25,101.35 270 top
U$31  95.25,96.27 270 top
U$32  95.25,91.19 270 top
U$37  95.25,86.11 270 top
U$38  95.25,81.03 270 top
U$39  95.25,75.95 270 top
U$40  95.25,70.87 270 top
U$41  95.25,65.79 270 top
U$42  95.25,60.71 270 top
U$43  95.25,50.55 270 top
U$44  95.25,45.47 270 top
U$49  95.25,40.39 270 top
U$50  95.25,35.31 270 top
U$51  95.25,30.23 270 top
U$52  95.25,25.15 270 top
U$53  95.25,20.07 270 top
U$54  95.25,14.99 270 top
U$55  95.25,9.91 270 top
U$56  95.25,4.83 270 top
U$62  41.91,106.43 0 top
U$64  57.15,68.33 180 top

### Tracks (layer width: path | path; a pad name or v marks a point on that pad's centre or on a via)
+5V
  pour Bottom (isolate 0.406, rank 2, no thermals): 0,113.03 116.08,113.03 116.08,0 0,0
BTLE_DFU  (via drill 0.35)
  Top 0.152: B1.A8 80.01,73.02 81.18,74.19 81.18,88.29 v81.79,88.9 | v68.07,101.35 67.06,101.35 v66.29,100.58 | v58.45,100.81 55.88,103.38 v52.83,103.38
  Bottom 0.152: v81.79,88.9 81.18,89.51 81.18,90.4 77.75,93.83 74.45,93.83 73.76,94.51 73.76,95.66 v68.07,101.35 | v66.29,100.58 66.07,100.81 v58.45,100.81 | v52.83,103.38 50.8,105.41 U$62.DFU
BTLE_MOD  (via drill 0.35)
  Top 0.152: v35.81,103.12 33.02,105.92 U$62.MOD
  Bottom 0.152: B1.17 33.76,76.69 33.76,84.56 31.73,86.59 30.9,86.59 29.69,87.79 29.69,95.26 32.92,98.49 32.92,99.2 35.81,102.09 v35.81,103.12
GND  (via drill 0.35, 0.4)
  Bottom 0.152: v82.8,87.38 81.66,87.38 80.49,88.54 78.84,88.54 B1.GND@2 | U$62.GND 48.26,105.92 v50.8,103.38
  pour Top (no thermals): 0,113.03 0,0 116.08,0 116.08,113.03
LED+_1
  Top 0.254: R1.P$2 11.73,6.1 CON1.P$2
LED+_2
  Top 0.254: R2.P$2 11.81,11.18 CON1.P$4
LED+_3
  Top 0.254: R3.P$2 11.89,16.26 CON1.P$6
LED+_4
  Top 0.254: R4.P$2 11.97,21.34 CON1.P$8
LED+_5
  Top 0.254: R5.P$2 12.05,26.42 CON1.P$10
LED+_6
  Top 0.254: R6.P$2 12.13,31.5 CON1.P$12
LED+_7
  Top 0.254: R7.P$2 12.21,36.58 CON1.P$14
LED+_8
  Top 0.254: R8.P$2 12.29,41.66 CON1.P$16
LED+_9
  Top 0.254: R9.P$2 12.37,46.74 CON1.P$18
LED+_10
  Top 0.254: R10.P$2 12.45,51.82 CON1.P$20
LED+_11
  Top 0.254: R11.P$2 11.73,61.98 CON2.P$2
LED+_12
  Top 0.254: R12.P$2 11.81,67.06 CON2.P$4
LED+_13
  Top 0.254: R13.P$2 11.89,72.14 CON2.P$6
LED+_14
  Top 0.254: R14.P$2 11.97,77.22 CON2.P$8
LED+_15
  Top 0.254: R15.P$2 12.05,82.3 CON2.P$10
LED+_16
  Top 0.254: R16.P$2 12.13,87.38 CON2.P$12
LED+_17
  Top 0.254: R17.P$2 12.21,92.46 CON2.P$14
LED+_18
  Top 0.254: R18.P$2 12.29,97.54 CON2.P$16
LED+_19
  Top 0.254: R19.P$2 12.37,102.62 CON2.P$18
LED+_20
  Top 0.254: R20.P$2 12.45,107.7 CON2.P$20
LED+_21
  Top 0.254: R21.P$2 98.76,103.89 CON3.P$2
LED+_22
  Top 0.254: R22.P$2 98.68,98.81 CON3.P$4
LED+_23
  Top 0.254: R23.P$2 98.6,93.73 CON3.P$6
LED+_24
  Top 0.254: CON3.P$8 95.32,90.06 94.82,89.56 92.35,89.56 R24.P$2
LED+_25
  Top 0.254: R25.P$2 91.45,83.58 93.92,83.58 95.4,85.06 CON3.P$10
LED+_26
  Top 0.254: R26.P$2 98.36,78.49 CON3.P$12
LED+_27
  Top 0.254: R27.P$2 98.28,73.41 CON3.P$14
LED+_28
  Top 0.254: R28.P$2 98.2,68.33 CON3.P$16
LED+_29
  Top 0.254: R29.P$2 91.69,63.5 98.37,63.5 CON3.P$18
LED+_30
  Top 0.254: R30.P$2 98.04,58.17 CON3.P$20
LED+_31
  Top 0.254: R31.P$2 92.2,48.77 100.44,48.77 CON4.P$2
LED+_32
  Top 0.254: R32.P$2 98.68,42.93 CON4.P$4
LED+_33
  Top 0.254: 100.38,39.12 99.87,38.61 | 100.38,39.12 CON4.P$6 | R33.P$2 98.6,37.85 100.38,39.12
LED+_34
  Top 0.254: R34.P$2 98.52,32.77 CON4.P$8
LED+_35
  Top 0.254: R35.P$2 98.44,27.69 CON4.P$10
LED+_36
  Top 0.254: R36.P$2 98.36,22.61 CON4.P$12
LED+_37
  Top 0.254: R37.P$2 98.28,17.53 CON4.P$14
LED+_38
  Top 0.254: R38.P$2 98.2,12.45 CON4.P$16
LED+_39
  Top 0.254: R39.P$2 98.12,7.37 CON4.P$18
LED+_40
  Top 0.254: R40.P$2 98.04,2.29 CON4.P$20
LED-_1
  Top 0.305: CON1.P$1 15.14,3.19 U$3.P$3
LED-_2
  Top 0.305: CON1.P$3 15.06,8.19 U$4.P$3
LED-_3
  Top 0.305: CON1.P$5 14.98,13.19 U$5.P$3
LED-_4
  Top 0.305: CON1.P$7 14.9,18.19 U$6.P$3
LED-_5
  Top 0.305: CON1.P$9 14.82,23.19 U$7.P$3
LED-_6
  Top 0.305: CON1.P$11 14.74,28.19 U$8.P$3
LED-_7
  Top 0.305: CON1.P$13 14.66,33.19 U$9.P$3
LED-_8
  Top 0.305: CON1.P$15 14.58,38.19 U$10.P$3
LED-_9
  Top 0.305: CON1.P$17 14.5,43.19 U$15.P$3
LED-_10
  Top 0.305: CON1.P$19 14.42,48.19 U$16.P$3
LED-_11
  Top 0.305: CON2.P$1 15.14,59.07 U$17.P$3
LED-_12
  Top 0.305: CON2.P$3 15.06,64.07 U$18.P$3
LED-_13
  Top 0.305: CON2.P$5 14.98,69.07 U$19.P$3
LED-_14
  Top 0.305: CON2.P$7 14.9,74.07 U$20.P$3
LED-_15
  Top 0.305: CON2.P$9 14.82,79.07 U$21.P$3
LED-_16
  Top 0.305: CON2.P$11 14.74,84.07 U$22.P$3
LED-_17
  Top 0.305: CON2.P$13 14.66,89.07 U$1.P$3
LED-_18
  Top 0.305: CON2.P$15 14.58,94.07 U$2.P$3
LED-_19
  Top 0.305: CON2.P$17 14.5,99.07 U$27.P$3
LED-_20
  Top 0.305: CON2.P$19 14.42,104.07 U$28.P$3
LED-_21
  Top 0.254: U$29.P$3 97.38,107.56 CON3.P$1
LED-_22
  Top 0.254: U$30.P$3 97.46,102.56 CON3.P$3
LED-_23
  Top 0.254: U$31.P$3 97.54,97.56 CON3.P$5
LED-_24
  Top 0.254: U$32.P$3 97.62,92.56 CON3.P$7
LED-_25
  Top 0.254: U$37.P$3 97.7,87.56 CON3.P$9
LED-_26
  Top 0.254: U$38.P$3 97.78,82.56 CON3.P$11
LED-_27
  Top 0.254: U$39.P$3 97.86,77.56 CON3.P$13
LED-_28
  Top 0.254: U$40.P$3 97.94,72.56 CON3.P$15
LED-_29
  Top 0.254: U$41.P$3 98.02,67.56 CON3.P$17
LED-_30
  Top 0.254: U$42.P$3 98.1,62.56 CON3.P$19
LED-_31
  Top 0.254: U$43.P$3 97.38,51.68 CON4.P$1
LED-_32
  Top 0.254: U$44.P$3 97.46,46.68 CON4.P$3
LED-_33
  Top 0.254: U$49.P$3 97.54,41.68 CON4.P$5
LED-_34
  Top 0.254: U$50.P$3 97.62,36.68 CON4.P$7
LED-_35
  Top 0.254: U$51.P$3 97.7,31.68 CON4.P$9
LED-_36
  Top 0.254: U$52.P$3 97.78,26.68 CON4.P$11
LED-_37
  Top 0.254: U$53.P$3 97.86,21.68 CON4.P$13
LED-_38
  Top 0.254: U$54.P$3 97.94,16.68 CON4.P$15
LED-_39
  Top 0.254: U$55.P$3 98.02,11.68 CON4.P$17
LED-_40
  Top 0.254: U$56.P$3 98.1,6.68 CON4.P$19
LED_CTRL_1  (via drill 0.33)
  Top 0.152: v47.94,43.72 47.94,44.51 R41.P$16 | R46.P$1 48.1,37.37 v48.1,41.97 48.1,42.45 49.21,43.56 49.21,45.94 38.42,56.74 31.91,56.74 B1.2
  Bottom 0.152: v48.1,41.97 48.1,43.56 v47.94,43.72
LED_CTRL_2
  Top 0.152: 48.42,45.31 47.94,45.31 47.47,44.83 47.47,44.67 R41.P$15 | 48.42,45.31 48.58,45.31 48.9,44.99 48.9,43.72 47.47,42.29 47.47,37.37 R46.P$2 | 48.42,45.31 48.42,46.26 40.48,54.2 31.91,54.2 B1.3
LED_CTRL_3  (via drill 0.33)
  Top 0.152: 46.99,41.97 46.99,42.29 47.31,42.61 47.31,43.88 46.99,44.2 46.99,44.51 R41.P$14 | 46.99,41.97 46.99,37.37 R46.P$3 | v46.83,41.97 46.99,41.97
  Bottom 0.152: v46.83,41.97 47.31,42.45 47.31,43.24 45.4,45.15 38.42,45.15 B1.4
LED_CTRL_4  (via drill 0.33)
  Top 0.152: v48.74,37.21 48.26,36.73 46.67,36.73 46.51,36.89 46.51,37.21 R46.P$4 | v46.67,42.93 46.67,44.04 46.51,44.2 46.51,44.51 R41.P$13
  Bottom 0.152: v48.74,37.21 48.74,39.12 46.2,41.66 46.2,42.45 | v46.67,42.93 46.2,42.45 | 46.2,42.45 38.58,42.45 B1.5
LED_CTRL_5  (via drill 0.33)
  Top 0.152: R46.P$5 46.04,37.37 v46.04,40.86 46.04,44.51 R41.P$12
  Bottom 0.152: v46.04,40.86 37.62,40.86 B1.6
LED_CTRL_6  (via drill 0.33)
  Top 0.152: R41.P$11 45.4,44.51 45.4,37.37 R46.P$6 45.4,37.21 45.4,36.89 45.24,36.73 40.64,36.73 v39.69,37.69
  Bottom 0.152: v39.69,37.69 33.66,43.72 32.23,43.72 B1.7
LED_CTRL_7
  Top 0.152: R46.P$7 44.93,37.37 44.93,44.51 R41.P$10 44.93,44.67 44.93,44.99 44.61,45.31 36.83,45.31 31.75,40.23 B1.8
LED_CTRL_8
  Top 0.152: 44.45,38.32 44.45,44.51 R41.P$9 | 44.45,38.32 44.45,37.37 R46.P$8 | 44.45,38.32 32.54,38.32 31.75,37.53 B1.9
LED_CTRL_9  (via drill 0.33)
  Top 0.152: 67.79,36.89 68.26,37.37 68.26,44.04 67.63,44.67 R42.P$16 | 67.79,36.89 67.63,36.73 R47.P$1 | 67.79,36.89 68.42,36.26 68.42,34.35 52.55,18.48 v32.07,18.48
  Bottom 0.152: v32.07,18.48 30.16,18.48 27.78,20.86 27.78,31.02 31.75,34.99 B1.10
LED_CTRL_10  (via drill 0.33)
  Top 0.152: R47.P$2 67.15,36.73 67.15,37.21 67.31,37.37 v67.31,38.96 67.31,43.88 66.99,44.2 66.99,44.51 R42.P$15
  Bottom 0.152: v67.31,38.96 67.31,38.48 67.63,38.16 67.63,34.04 62.87,29.27 43.5,29.27 36.04,21.81 35.4,21.81 33.02,24.19 33.02,25.3 32.07,26.26 31.11,26.26 30.48,26.89 30.48,30.39 31.75,31.66 B1.11
LED_CTRL_11  (via drill 0.33)
  Top 0.152: 66.52,37.69 66.52,44.51 R42.P$14 | 66.52,37.69 66.52,36.73 R47.P$3 | v66.67,37.69 66.52,37.69
  Bottom 0.152: v66.67,37.69 50.16,37.69 48.1,35.62 37.47,35.62 31.75,29.91 B1.12
LED_CTRL_12  (via drill 0.33)
  Top 0.152: R47.P$4 66.04,36.73 66.04,44.51 R42.P$13 66.04,44.67 66.04,44.83 65.56,45.31 62.71,45.31 62.55,45.47 59.05,45.47 43.81,30.23 v42.55,30.23
  Bottom 0.152: v42.55,30.23 34.61,30.23 31.75,27.37 B1.13
LED_CTRL_13  (via drill 0.33)
  Top 0.152: 65.56,43.72 65.56,44.51 R42.P$12 | 65.56,43.72 65.56,36.73 R47.P$5 | v65.41,43.72 65.56,43.72 | B1.22 v38.89,87.85
  Bottom 0.152: v65.41,43.72 64.93,43.72 57.47,51.18 46.99,51.18 38.89,59.28 v38.89,87.85
LED_CTRL_14  (via drill 0.33)
  Top 0.152: 64.77,43.4 64.93,43.24 64.93,36.73 R47.P$6 | 64.77,43.4 64.77,44.04 64.93,44.2 64.93,44.51 R42.P$11 | v64.14,42.77 64.77,43.4
  Bottom 0.152: v64.14,42.77 55.72,42.77 54.29,44.2 52.55,44.2 36.35,60.39 36.35,87.06 33.02,90.39 33.02,93.73 B1.23
LED_CTRL_15  (via drill 0.33)
  Top 0.152: R47.P$7 64.45,36.73 64.45,41.5 63.5,42.45 63.5,43.24 v63.98,43.72 64.45,44.2 64.45,44.51 R42.P$10
  Bottom 0.152: v63.98,43.72 55.24,43.72 54.45,44.51 52.7,44.51 37.31,59.91 37.31,91.98 B1.24
LED_CTRL_16  (via drill 0.33)
  Top 0.152: 63.18,43.88 63.18,42.29 63.98,41.5 63.98,36.73 R47.P$8 | 63.18,43.88 63.98,44.67 R42.P$9 | v62.23,44.83 63.18,43.88
  Bottom 0.152: v62.23,44.83 52.86,44.83 38.26,59.44 38.26,91.82 38.1,91.98 38.1,93.73 B1.25
LED_CTRL_17
  Top 0.152: R48.P$1 37.23,99.56 37.23,99.33 38.2,98.37 38.2,94.51 39.37,93.34 39.37,92.61 | 39.37,92.61 41.12,90.87 47.15,90.87 48.26,91.98 48.26,102.62 R43.P$16 | 39.37,92.61 B1.26
LED_CTRL_18  (via drill 0.33)
  Top 0.152: B1.27 38.51,95.86 38.51,98.49 37.61,99.39 R48.P$2 | v48.74,103.41 48.1,103.41 47.78,103.09 47.78,102.78 R43.P$15
  Bottom 0.152: v48.74,103.41 46.99,101.66 46.2,101.66 39.53,95 B1.27
LED_CTRL_19  (via drill 0.33)
  Top 0.152: R48.P$3 38.23,99.56 38.23,99.33 40.74,96.83 40.74,94.51 41.91,93.34 B1.28 | v47.47,99.76 47.47,101.35 47.31,101.5 47.31,102.62 R43.P$14
  Bottom 0.152: v47.47,99.76 43.18,95.47 43.18,93.73 B1.28
LED_CTRL_20  (via drill 0.33)
  Top 0.152: B1.29 41.05,95.86 41.05,96.95 38.61,99.39 R48.P$4 | v46.83,101.03 46.83,102.62 R43.P$13
  Bottom 0.152: v46.83,101.03 41.91,96.11 B1.29
LED_CTRL_21  (via drill 0.33)
  Top 0.152: R48.P$5 39.23,99.56 39.23,99.33 43.28,95.29 43.28,94.51 44.45,93.34 B1.30 | v46.2,96.42 46.2,102.62 R43.P$12
  Bottom 0.152: v46.2,96.42 46.2,95.95 45.72,95.47 45.72,93.73 B1.30
LED_CTRL_22
  Top 0.152: B1.31 44,95 39.61,99.39 R48.P$6 39.69,99.76 39.69,100.08 39.85,100.23 40.64,100.23 43.66,103.25 45.56,103.25 45.72,103.09 45.72,102.78 R43.P$11
LED_CTRL_23  (via drill 0.33)
  Top 0.152: B1.32 46.99,93.34 45.82,94.51 45.82,95.48 42.1,99.2 40.37,99.2 40.23,99.33 40.23,99.56 R48.P$7 40.16,99.44 40.16,99.28 40.8,98.65 v42.07,98.65 | v45.4,101.73 45.24,102.14 45.24,102.62 R43.P$10
  Bottom 0.152: v42.07,98.65 42.51,98.65 42.93,99.06 v45.4,101.73
LED_CTRL_24
  Top 0.152: B1.33 46.74,95 42.5,99.23 | R48.P$8 40.79,99.51 42.23,99.51 42.5,99.23 | 42.5,99.23 44.61,101.35 44.61,102.62 R43.P$9
LED_CTRL_25  (via drill 0.33)
  Top 0.152: R44.P$16 64.61,102.46 v65.25,102.46 68.74,102.46 R49.P$1
  Bottom 0.152: v65.25,102.46 57.78,102.46 50.8,95.47 50.8,93.73 B1.34
LED_CTRL_26
  Top 0.152: R49.P$2 69.24,101.34 69.24,101.11 67.04,98.92 | B1.35 50.42,95 52.8,97.38 65.51,97.38 67.04,98.92 | 67.04,98.92 63.98,101.98 63.98,102.46 R44.P$15
LED_CTRL_27  (via drill 0.33)
  Top 0.152: v61.59,99.76 63.5,101.66 63.5,102.46 R44.P$14 | v66.83,103.09 66.99,103.25 69.37,103.25 69.85,102.78 69.85,102.62 R49.P$3
  Bottom 0.152: v61.59,99.76 59.85,99.76 57.25,97.16 | 57.25,97.16 55.88,95.79 55.88,94.52 55.09,93.73 53.34,93.73 B1.36 | v66.83,103.09 65.56,101.82 62.07,101.82 61.75,102.14 61.12,102.14 60.8,101.82 60.77,101.85 58.67,101.85 57.25,100.43 57.25,97.16
LED_CTRL_28  (via drill 0.33)
  Top 0.152: B1.37 52.53,95 54.61,97.08 66.21,97.08 69.85,100.72 v69.85,101.5 69.85,101.74 70.24,102.13 70.24,102.35 R49.P$4 | v65.88,103.25 63.5,103.25 63.02,102.78 63.02,102.62 R44.P$13
  Bottom 0.152: v65.88,103.25 66.36,103.73 67.63,103.73 v69.85,101.5
LED_CTRL_29  (via drill 0.33)
  Top 0.152: R49.P$5 70.74,101.34 70.74,101.11 66.4,96.77 54.74,96.77 53.44,95.48 53.44,94.51 54.61,93.34 B1.38 | v60.96,98.01 60.96,100.08 62.39,101.5 62.39,102.46 R44.P$12
  Bottom 0.152: v60.96,98.01 58.42,95.47 58.42,94.52 57.63,93.73 55.88,93.73 B1.38
LED_CTRL_30  (via drill 0.33)
  Top 0.152: R49.P$6 71.24,101.34 71.24,101.11 66.6,96.47 56.97,96.47 55.5,95 B1.39 | R44.P$11 61.91,102.62 61.91,102.78 61.59,103.09 59.28,103.09 59.02,102.83 59.03,101.05 59.03,100.57 58.69,100.23 57.94,100.23 v55.72,98.01
  Bottom 0.152: v55.72,98.01 55.72,96.9 54.61,95.79 B1.39
LED_CTRL_31  (via drill 0.33)
  Top 0.152: 69.21,98.65 71.55,100.99 71.55,101.32 71.62,102.01 71.74,102.13 71.74,102.35 R49.P$7 | 69.21,98.65 66.72,96.16 59.21,96.16 58.52,95.48 58.52,93.83 B1.40 | v61.44,101.5 61.44,102.46 R44.P$10 | v69.69,98.65 69.22,98.65 69.21,98.65
  Bottom 0.152: v61.44,101.5 66.83,101.5 v69.69,98.65
LED_CTRL_32  (via drill 0.33)
  Top 0.152: v59.37,98.01 59.37,100.87 60.96,102.46 R44.P$9 | v69.69,97.69 72.39,100.39 72.39,102.46 R49.P$8
  Bottom 0.152: B1.41 57.15,95.79 v59.37,98.01 60.33,98.97 68.42,98.97 v69.69,97.69
LED_CTRL_33  (via drill 0.33)
  Top 0.152: v72.39,22.07 71.91,21.34 R45.P$16 | 76.99,21.81 77.47,21.34 R50.P$1 | 76.99,21.81 76.99,76.42 v64.14,89.28 | v76.2,22.07 76.45,21.81 76.99,21.81
  Bottom 0.152: v76.2,22.07 v72.39,22.07 | v64.14,89.28 62.23,91.19 61.75,91.19 60.48,92.46 B1.42
LED_CTRL_34
  Top 0.152: 73.03,20.86 77.47,20.86 R50.P$2 | 73.03,20.86 71.91,20.86 R45.P$15 | 73.03,20.86 73.03,53.4 72.23,54.2 72.23,63.88 71.75,64.36 71.75,80.23 60.96,91.03 60.96,93.73 B1.43
LED_CTRL_35  (via drill 0.33)
  Top 0.152: R50.P$3 77.47,20.38 71.91,20.38 R45.P$14 71.75,20.38 71.44,20.38 71.28,20.54 v71.28,56.1
  Bottom 0.152: v71.28,56.1 71.28,62.29 72.23,63.25 72.23,66.42 71.75,66.9 71.75,73.09 74.3,75.63 74.3,91.34 73.66,91.98 73.66,92.93 72.87,93.73 63.5,93.73 B1.44
LED_CTRL_36  (via drill 0.33)
  Top 0.152: 72.71,19.91 75.56,19.91 75.72,20.07 76.99,20.07 77.15,19.91 77.47,19.91 R50.P$4 | 72.71,19.91 71.91,19.91 R45.P$13 | v72.71,19.75 72.71,19.91 | v72.87,55.47 72.87,79.6 63.5,88.96 63.5,93.73 B1.45
  Bottom 0.152: v72.71,19.75 72.71,20.54 71.75,21.5 71.75,54.36 v72.87,55.47
LED_CTRL_37  (via drill 0.33)
  Top 0.152: 76.04,19.11 77.15,19.11 77.31,19.27 77.47,19.27 R50.P$5 | 76.04,19.11 72.39,19.11 72.23,19.27 71.91,19.27 R45.P$12 | v76.04,19.43 76.04,19.11 | v74.93,81.5 64.77,91.66 B1.46
  Bottom 0.152: v76.04,19.43 76.04,20.7 77.63,22.29 77.63,23.56 83.98,29.91 83.98,69.91 80.49,73.41 79.53,73.41 74.93,78.01 v74.93,81.5
LED_CTRL_38
  Top 0.152: R45.P$11 71.91,18.8 77.47,18.8 R50.P$6 77.63,18.8 77.95,18.8 78.11,18.95 78.11,21.65 77.47,22.29 77.47,80.07 66.04,91.5 66.04,93.73 B1.47
LED_CTRL_39  (via drill 0.33)
  Top 0.152: R50.P$7 77.47,18.32 71.91,18.32 R45.P$10 71.75,18.32 71.44,18.32 71.28,18.48 71.28,20.07 70.96,20.38 70.96,55.47 70.64,55.78 70.64,56.42 71.75,57.53 71.75,63.88 71.44,64.2 71.44,79.44 v63.02,87.85
  Bottom 0.152: v63.02,87.85 63.5,87.85 64.29,88.65 64.45,88.65 67.31,91.5 B1.48
LED_CTRL_40  (via drill 0.33)
  Top 0.152: 76.68,17.84 77.47,17.84 R50.P$8 | 76.68,17.84 71.91,17.84 R45.P$9 | v76.68,17.68 76.68,17.84 | v78.26,22.45 78.26,70.55 77.79,71.03 77.79,87.53 76.2,89.12 76.2,95.47 75.09,96.58 68.9,96.58 B1.49
  Bottom 0.152: v76.68,17.68 76.68,20.86 v78.26,22.45
LORA_CS
  Top 0.152: U$64.P$8 48.1,81.82 33.81,81.82 B1.19
LORA_G0  (via drill 0.33)
  Top 0.152: v45.4,80.55 35.08,80.55 B1.18
  Bottom 0.152: U$64.P$4 58.58,80.39 57.15,78.96 46.99,78.96 v45.4,80.55
LORA_RST
  Top 0.152: U$64.P$9 46.2,80.39 38.1,72.3 31.91,72.3 B1.16
MCU_5V
  Bottom 0.152: 44.37,76.5 45.16,77.29 64.21,77.29 U$64.P$1 | 44.37,76.5 44.37,57.61 45.16,56.82 69.75,56.82 71.04,55.53 71.52,55.53 72.54,56.55 72.54,67.5 77.91,67.5 79.53,65.89 80.29,65.89 81.18,65 81.18,38.63 80.01,37.46 B1.5V@0 | 44.37,76.5 44.37,90.73 45.62,91.97 45.62,93.19 46.25,93.83 47.47,93.83 48.16,94.51 48.16,95.72 49.31,96.87 49.31,103.65 48.97,103.98 45.62,103.98 U$62.VIN
  pour Bottom: 27.69,112.27 27.94,18.8 43.18,18.8 43.18,27.69 83.82,27.69 83.57,112.27
MISO
  Bottom 0.152: U$64.P$6 B1.50
MOSI  (via drill 0.33)
  Top 0.152: v68.58,90.71 68.58,93.73 B1.51
  Bottom 0.152: U$64.P$7 53.18,80.39 54.29,79.28 54.93,79.28 56.04,80.39 56.04,80.71 57.94,82.61 59.37,82.61 64.93,88.17 66.04,88.17 v68.58,90.71
N$1  (via drill 0.33)
  Top 0.152: v32.86,36.58 33.02,36.42 47.78,36.42 47.94,36.26 47.94,35.94 R46.P$16 | v22.38,6.25 18.89,2.76 17.62,2.76 U$3.P$1
  Bottom 0.152: v32.86,36.58 32.54,36.58 32.23,36.26 31.27,36.26 26.19,31.18 26.19,19.91 22.38,16.1 v22.38,6.25
N$2  (via drill 0.33)
  Top 0.152: v47.62,34.99 47.47,35.15 47.47,35.78 R46.P$15 | v47.62,33.08 47.15,33.08 35.72,21.65 33.81,21.65 24.92,12.76 23.5,12.76 18.57,7.84 17.62,7.84 U$4.P$1
  Bottom 0.152: v47.62,33.08 v47.62,34.99
N$3  (via drill 0.33)
  Top 0.152: v46.99,34.35 46.99,35.78 R46.P$14 | v41.75,29.59 41.27,29.59 24.77,13.08 17.78,13.08 17.62,12.92 U$5.P$1
  Bottom 0.152: v46.99,34.35 46.99,33.72 42.86,29.59 v41.75,29.59
N$4
  Top 0.152: R46.P$13 46.51,35.78 46.51,35.31 29.21,18 17.62,18 U$6.P$1
N$5
  Top 0.152: R46.P$12 45.88,35.78 45.88,35.47 33.97,23.56 18.57,23.56 17.94,22.92 17.62,22.92 U$7.P$1
N$6
  Top 0.152: R46.P$11 45.4,35.78 45.4,35.62 41.12,31.34 26.04,31.34 22.86,28.16 17.62,28.16 U$8.P$1
N$7
  Top 0.152: R46.P$10 44.93,35.78 44.93,35.62 43.18,33.88 18.41,33.88 17.62,33.08 U$9.P$1
N$8
  Top 0.152: R46.P$9 44.45,35.94 32.54,35.94 32.07,36.42 26.35,36.42 24.61,38.16 17.62,38.16 U$10.P$1
N$9  (via drill 0.33)
  Top 0.152: v34.77,21.02 54.61,21.02 67.47,33.88 67.47,35.31 R47.P$16 | v25.4,29.43 v29.53,25.3 | v18.1,42.29 17.62,42.77 17.62,43.24 U$15.P$1
  Bottom 0.152: v34.77,21.02 32.07,23.72 31.11,23.72 v29.53,25.3 | v25.4,29.43 25.4,33.72 18.1,41.02 v18.1,42.29
N$10  (via drill 0.33)
  Top 0.152: v54.45,38.64 61.12,31.97 65.09,31.97 66.99,33.88 66.99,35.31 R47.P$15 | v39.69,46.1 36.04,46.1 32.54,42.61 30.32,42.61 24.61,48.32 17.62,48.32 U$16.P$1
  Bottom 0.152: v54.45,38.64 46.99,46.1 v39.69,46.1
N$11  (via drill 0.33)
  Top 0.152: v65.41,33.24 65.56,33.24 66.52,34.2 66.52,35.31 R47.P$14 | v53.34,38.8 v58.9,33.24 | v36.83,48.01 30,48.01 19.53,58.48 17.62,58.48 U$17.P$1
  Bottom 0.152: v58.9,33.24 v65.41,33.24 | v53.34,38.8 53.34,39.27 47.15,45.47 39.37,45.47 v36.83,48.01
N$12  (via drill 0.33)
  Top 0.152: v64.77,33.88 65.72,33.88 66.04,34.2 66.04,35.31 R47.P$13 | v55.56,40.07 v58.58,37.05 | v35.72,59.91 32.07,63.56 17.62,63.56 U$18.P$1
  Bottom 0.152: v64.77,33.88 61.75,33.88 v58.58,37.05 | v35.72,59.91 v55.56,40.07
N$13  (via drill 0.33)
  Top 0.152: v65.41,34.51 65.56,34.67 65.56,35.31 R47.P$12 | v55.56,41.02 v59.53,37.05 | v53.02,43.56 31.43,65.15 28.1,65.15 24.61,68.64 17.62,68.64 U$19.P$1
  Bottom 0.152: v65.41,34.51 62.07,34.51 v59.53,37.05 | v53.02,43.56 v55.56,41.02
N$14  (via drill 0.33)
  Top 0.152: v64.14,32.61 64.14,34.2 64.93,34.99 64.93,35.31 R47.P$11 | v55.09,42.45 32.07,65.47 28.57,65.47 20.32,73.72 17.62,73.72 U$20.P$1
  Bottom 0.152: v64.14,32.61 65.72,32.61 67.31,34.2 67.31,38.01 62.87,42.45 v55.09,42.45
N$15  (via drill 0.33)
  Top 0.152: v60.17,39.27 63.5,35.94 64.29,35.94 64.45,35.78 64.45,35.47 R47.P$10 | v18.1,77.85 17.62,78.33 17.62,78.8 U$21.P$1
  Bottom 0.152: v60.17,39.27 54.29,39.27 32.86,60.71 31.27,60.71 25.24,66.74 25.24,69.44 18.1,76.58 v18.1,77.85
N$16  (via drill 0.33)
  Top 0.152: v54.61,40.07 59.21,35.47 63.98,35.47 R47.P$9 | v35.72,63.25 35.24,63.25 32.7,65.79 31.27,65.79 26.04,71.03 26.04,78.17 20.32,83.88 17.62,83.88 U$22.P$1
  Bottom 0.152: v54.61,40.07 35.08,59.59 35.08,60.23 35.72,60.87 v35.72,63.25
N$17
  Top 0.152: U$1.P$1 19.95,91.4 20.76,91.4 30.33,100.98 R48.P$16
N$18
  Top 0.152: U$2.P$1 19.95,96.48 25.41,96.48 30.38,101.46 37.36,101.46 37.49,101.33 37.49,101.1 R48.P$15
N$19
  Top 0.152: U$27.P$1 19.36,100.98 29.47,100.98 30.25,101.76 37.55,101.76 37.99,101.33 37.99,101.1 R48.P$14
N$20
  Top 0.152: U$28.P$1 18.05,103.67 27.52,103.67 29.12,102.07 37.75,102.07 38.49,101.33 38.49,101.1 R48.P$13
N$21
  Top 0.152: R48.P$12 39.21,101.03 39.21,103.57 42.07,106.43 42.07,106.74 43.5,108.17 93.19,108.17 94.14,107.22 U$29.P$1
N$22
  Top 0.152: R48.P$11 39.69,101.03 39.69,101.5 44.61,106.43 44.61,106.74 45.72,107.86 81.6,107.86 87.15,102.3 94.14,102.3 U$30.P$1
N$23
  Top 0.152: R48.P$10 40.16,101.03 40.16,101.35 43.97,105.16 69.06,105.16 70.17,106.27 78.11,106.27 87.15,97.22 94.14,97.22 U$31.P$1
N$24
  Top 0.152: R48.P$9 40.64,101.03 44.45,104.84 69.22,104.84 70.33,105.95 77.63,105.95 91.44,92.14 94.14,92.14 U$32.P$1
N$25  (via drill 0.33)
  Top 0.152: v68.1,104.2 68.42,103.89 68.74,103.89 R49.P$16 | v93.66,88.01 94.14,87.53 94.14,87.06 U$37.P$1
  Bottom 0.152: v68.1,104.2 69.53,104.2 70.48,105.16 77.79,105.16 93.66,89.28 v93.66,88.01
N$26  (via drill 0.33)
  Top 0.152: v93.34,84.2 90.33,87.22 90.33,89.12 73.82,105.63 70.48,105.63 69.37,104.52 69.37,103.89 R49.P$15 | v94.61,82.93 94.14,82.45 94.14,81.98 U$38.P$1
  Bottom 0.152: v94.61,82.93 v93.34,84.2
N$27
  Top 0.152: R49.P$14 69.85,103.89 69.85,104.52 70.64,105.31 73.66,105.31 89.85,89.12 89.85,84.52 90.17,84.2 90.17,78.17 91.44,76.9 94.14,76.9 U$39.P$1
N$28  (via drill 0.33)
  Top 0.152: v76.2,99.44 72.39,103.25 70.64,103.25 70.33,103.57 70.33,103.73 R49.P$13 | v78.11,99.44 78.58,99.44 86.04,91.98 86.04,87.22 89.53,83.72 89.53,73.41 91.12,71.82 94.14,71.82 U$40.P$1
  Bottom 0.152: v78.11,99.44 v76.2,99.44
N$29  (via drill 0.33)
  Top 0.152: U$41.P$1 84.24,66.74 84.19,66.79 | 84.19,66.79 83.16,67.82 | v70.8,104.52 70.8,103.89 R49.P$12 | v74.14,98.97 74.14,98.49 77.15,95.47 77.15,89.12 78.42,87.85 78.42,71.5 83.19,66.74 84.14,66.74 84.19,66.79
  Bottom 0.152: v70.8,104.52 70.8,102.3 v74.14,98.97
N$30  (via drill 0.33)
  Top 0.152: v93.34,74.04 89.85,77.53 89.85,84.04 89.53,84.36 89.53,88.96 73.5,105 72.23,105 71.44,104.2 71.44,103.89 R49.P$11 | v93.66,62.61 94.14,62.13 94.14,61.66 U$42.P$1
  Bottom 0.152: v93.34,74.04 93.66,73.72 v93.66,62.61
N$31  (via drill 0.33)
  Top 0.152: v73.5,104.05 72.87,104.68 72.39,104.68 71.91,104.2 71.91,103.89 R49.P$10 | v73.5,100.55 73.5,98.65 76.83,95.31 76.83,88.96 78.11,87.69 78.11,71.18 89.85,59.44 89.85,56.26 94.14,51.98 94.14,51.5 U$43.P$1
  Bottom 0.152: v73.5,100.55 v73.5,104.05
N$32  (via drill 0.33)
  Top 0.152: v86.52,85.79 80.96,91.34 80.17,91.34 77.47,94.04 77.47,99.12 72.87,103.73 72.39,103.73 R49.P$9 | v93.66,47.37 94.14,46.9 94.14,46.42 U$44.P$1
  Bottom 0.152: v86.52,85.79 86.52,55.78 93.66,48.64 v93.66,47.37
N$33
  Top 0.152: R50.P$16 78.9,21.34 78.9,26.89 93.19,41.18 94.14,41.18 U$49.P$1
N$34
  Top 0.152: R50.P$15 78.9,20.86 79.22,20.86 89.85,31.5 89.85,33.08 92.87,36.1 94.14,36.1 U$50.P$1
N$35
  Top 0.152: R50.P$14 78.9,20.38 82.55,20.38 93.19,31.02 94.14,31.02 U$51.P$1
N$36
  Top 0.152: R50.P$13 78.9,19.91 82.87,19.91 88.9,25.94 94.14,25.94 U$52.P$1
N$37
  Top 0.152: R50.P$12 78.9,19.27 92.39,19.27 94.14,21.02 U$53.P$1
N$38
  Top 0.152: R50.P$11 78.9,18.8 84.3,18.8 87.15,15.94 94.14,15.94 U$54.P$1
N$39
  Top 0.152: R50.P$10 78.9,18.32 79.69,18.32 87.15,10.86 94.14,10.86 U$55.P$1
N$40
  Top 0.152: R50.P$9 78.9,17.68 90.81,5.78 94.14,5.78 U$56.P$1
RX3
  Bottom 0.152: U$62.TXO 37.47,106.43 26.99,95.95 26.99,74.36 B1.15
SCK
  Bottom 0.152: U$64.P$5 B1.52
TX3  (via drill 0.33)
  Top 0.152: v33.5,98.97 29.21,94.68 29.21,69.6 B1.14
  Bottom 0.152: U$62.RXI 40.64,106.11 v33.5,98.97

### Text on the board
tPlace: BLUETOOTH MODULE | BT BODY DIR | TinkerTech / LED Messaging / Board V1.0 | +5V IN | GND IN